# EAGLE design untitled (EAGLE 9.6.2)
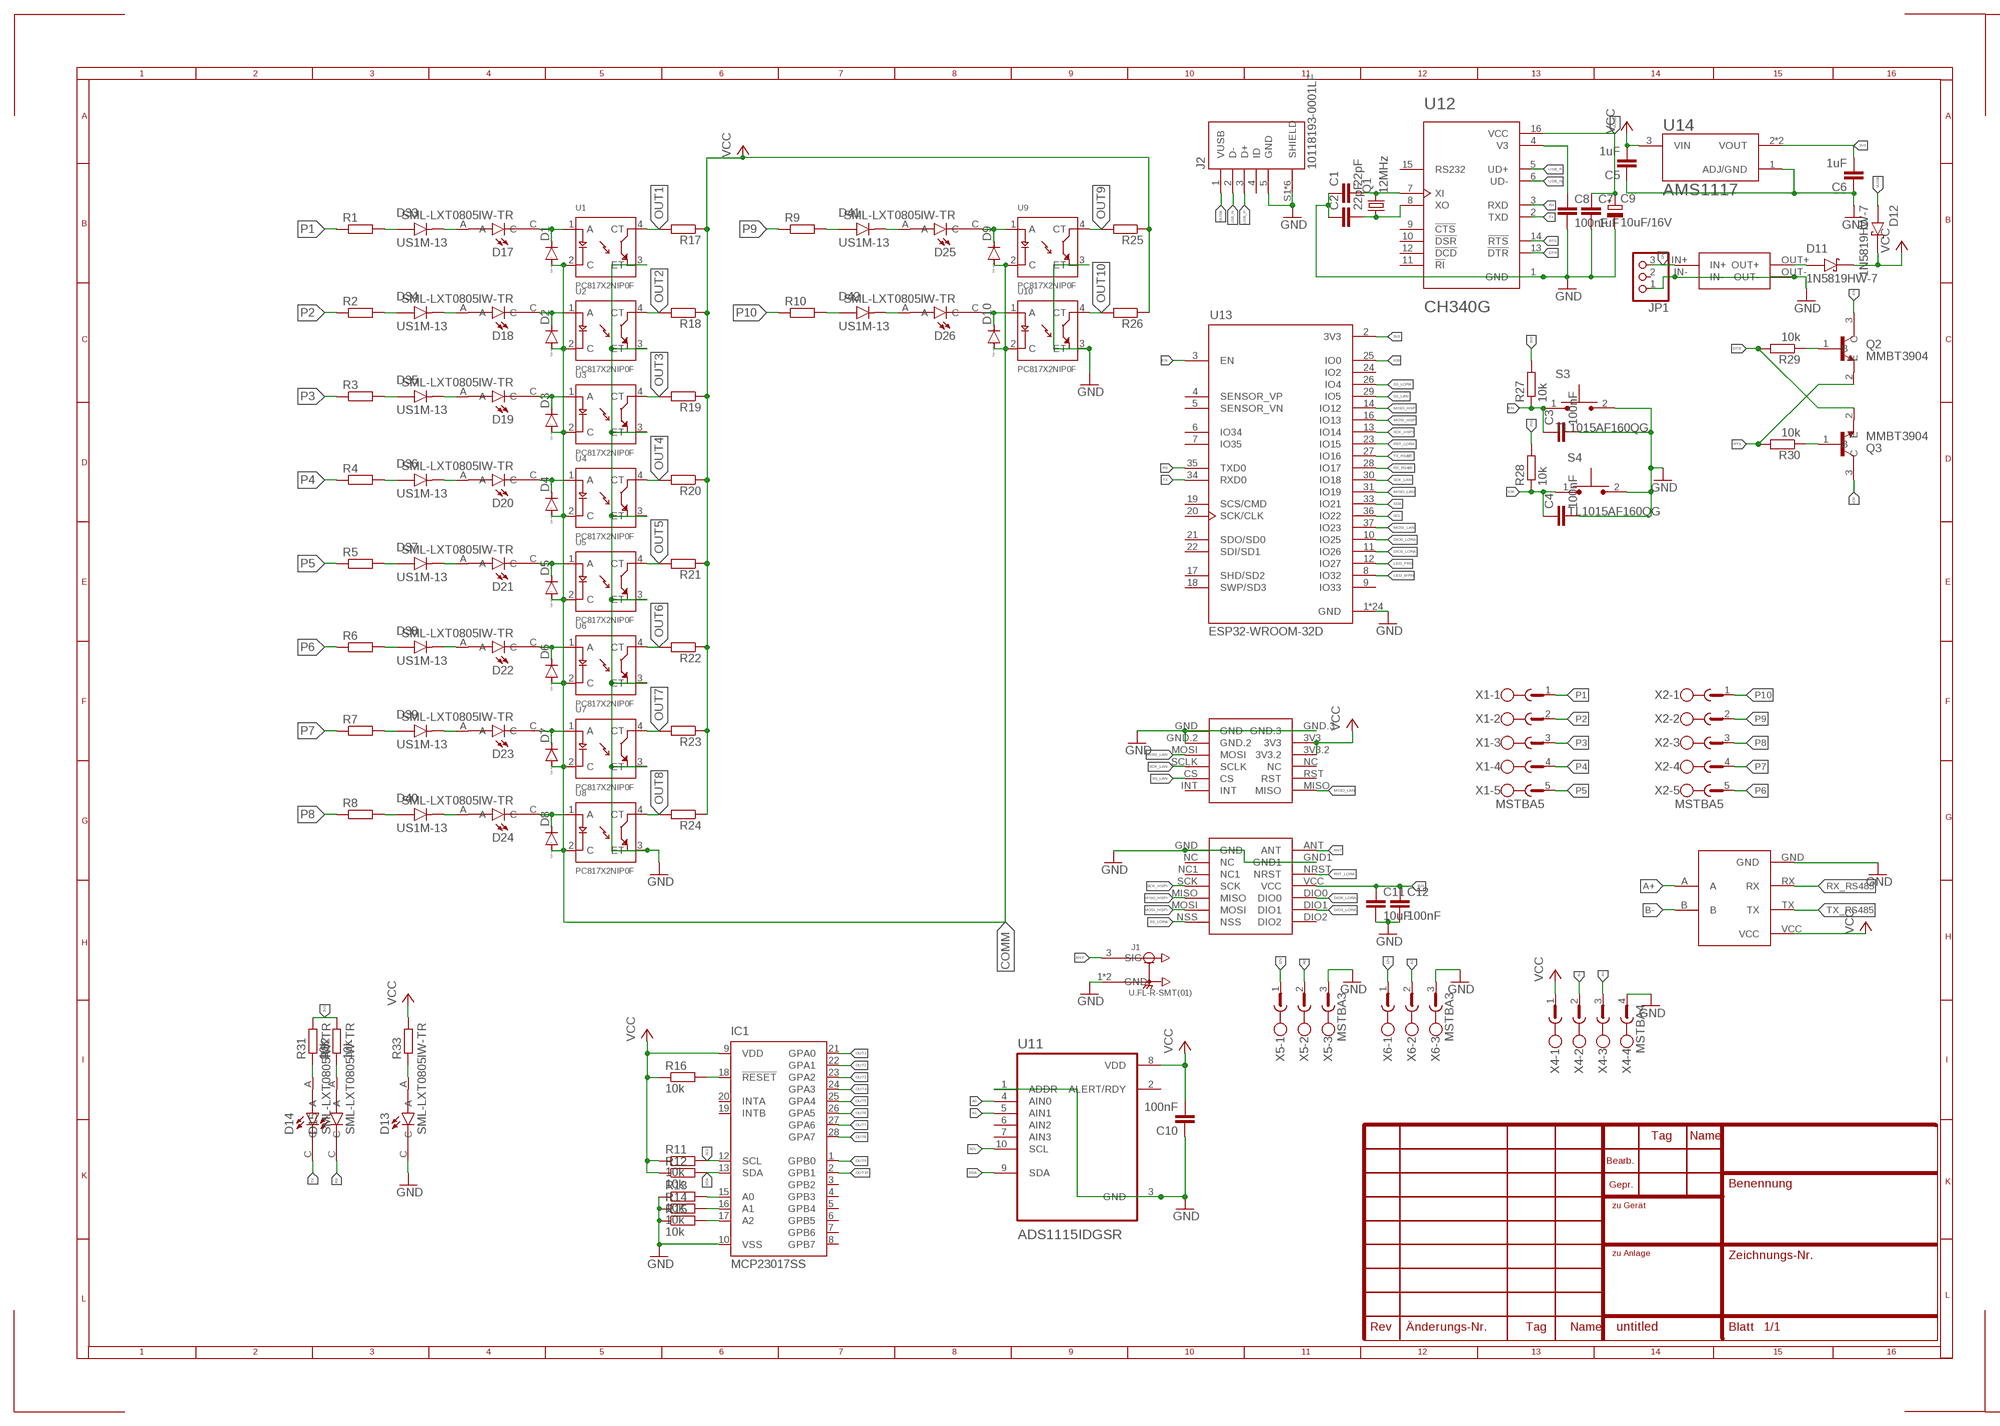
[diagram p0: schematic, sheet 1, part 1 of 2]
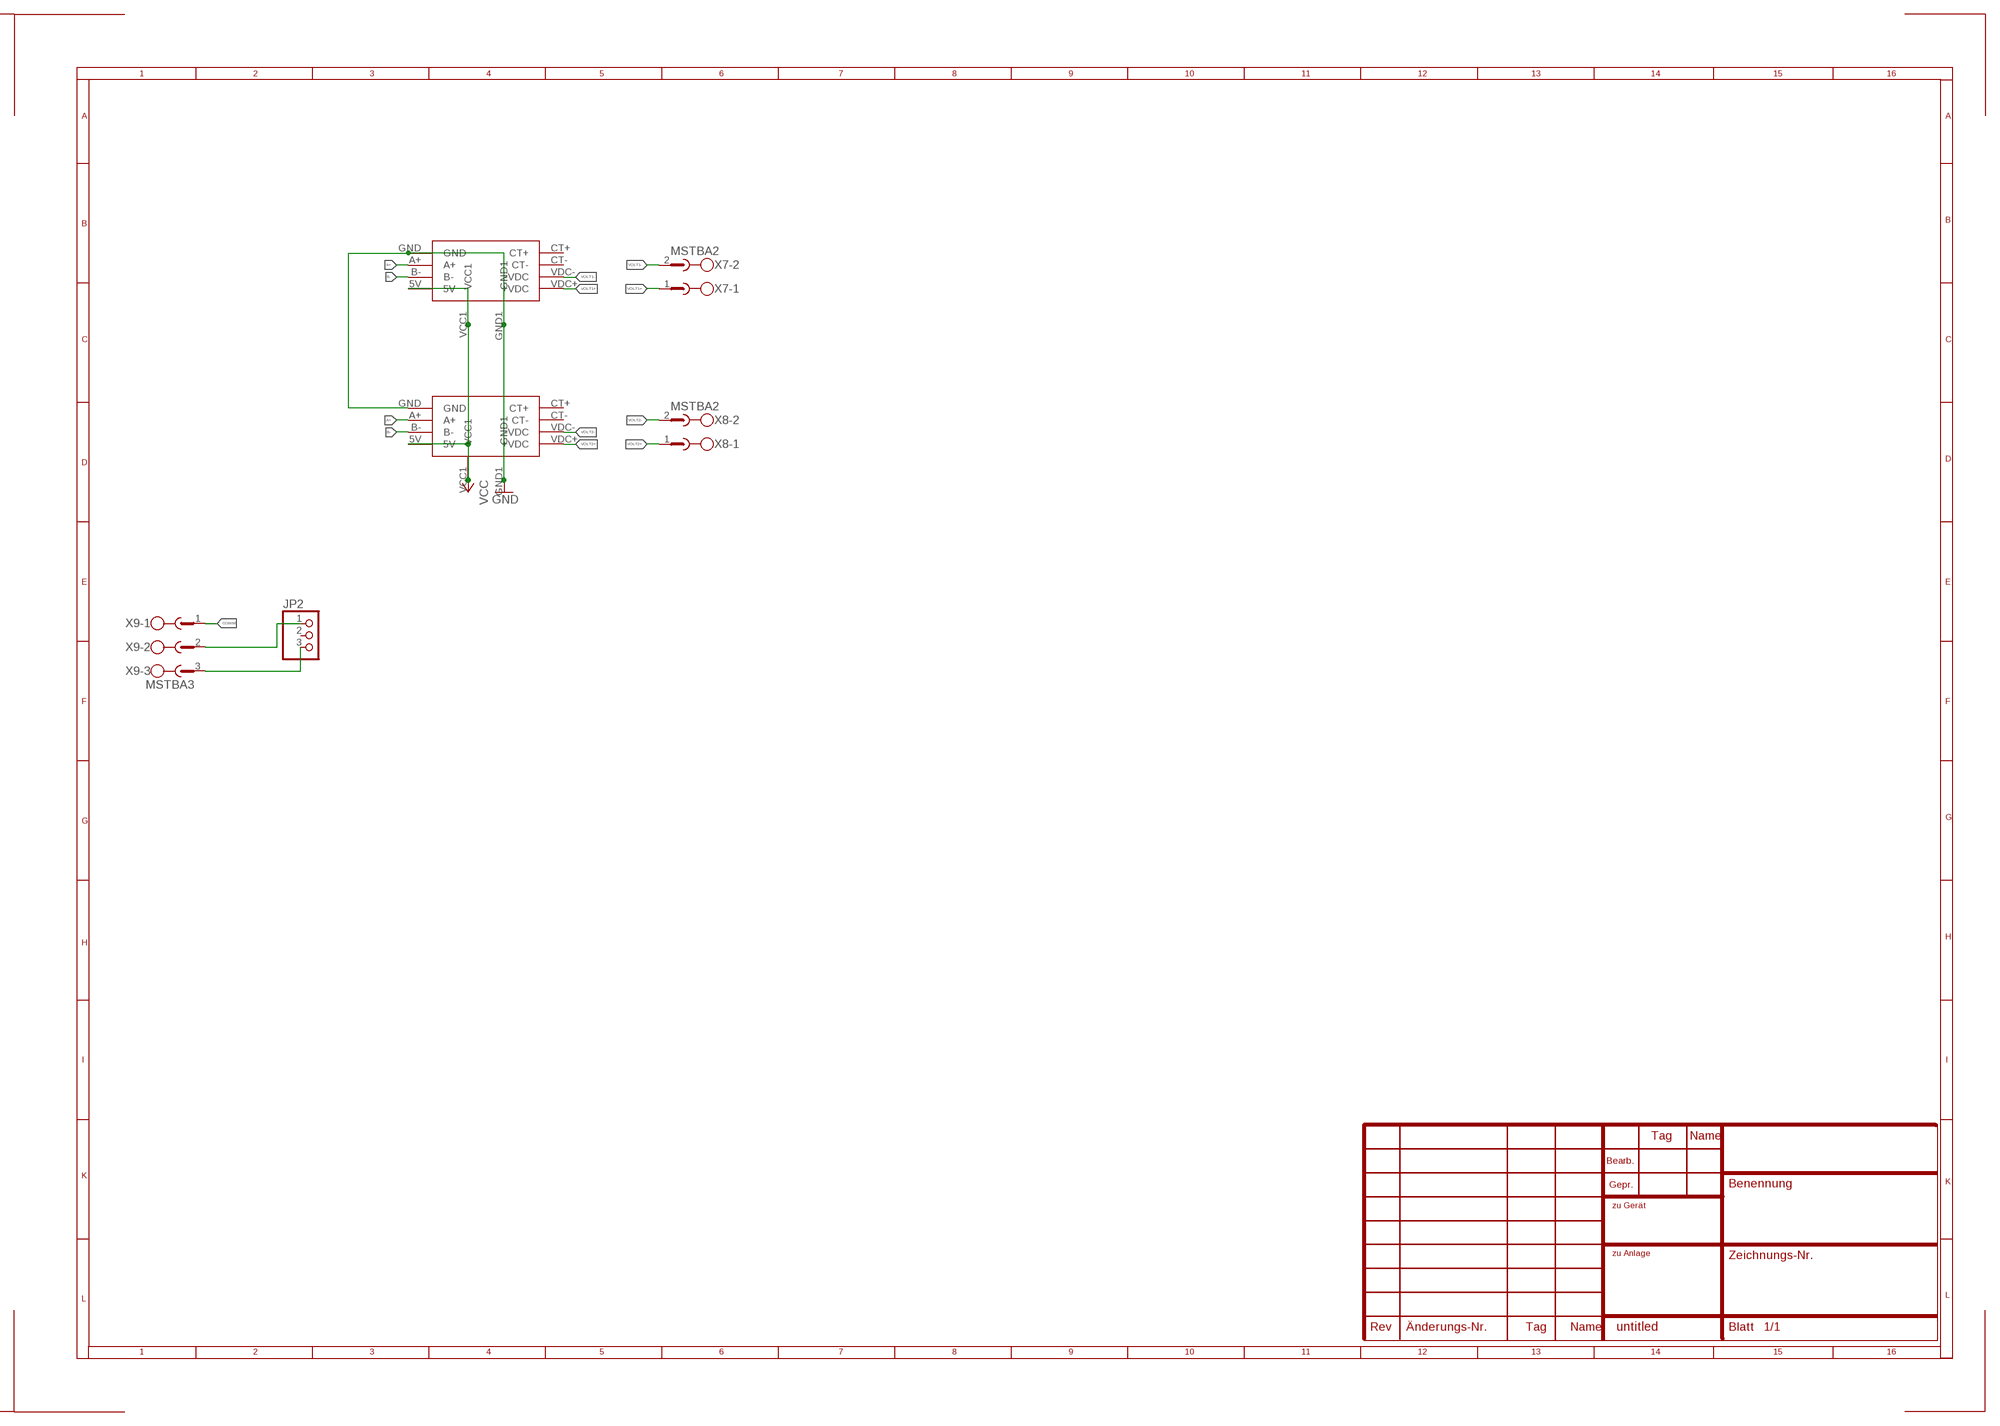
[diagram p1: schematic, sheet 1, part 2 of 2]

## Parts
C1  22pF  C-EUC0805K  [C0805K]
C2  22pF  C-EUC0805K  [C0805K]
C3  100nF  C-EUC0805K  [C0805K]
C4  100nF  C-EUC0805K  [C0805K]
C5  1uF  C-EUC0805K  [C0805K]
C6  1uF  C-EUC0805K  [C0805K]
C7  1uF  C-EUC0805K  [C0805K]
C8  100nF  C-EUC0805K  [C0805K]
C9  10uF/16V  CPOL-EU153CLV-0505  [153CLV-0505]
C10  100nF  C-EUC0805K  [C0805K]
C11  10uF  C-EUC0805K  [C0805K]
C12  100nF  C-EUC0805K  [C0805K]
D1  DIODE-SOD123  [SOD123]
D2  DIODE-SOD123  [SOD123]
D3  DIODE-SOD123  [SOD123]
D4  DIODE-SOD123  [SOD123]
D5  DIODE-SOD123  [SOD123]
D6  DIODE-SOD123  [SOD123]
D7  DIODE-SOD123  [SOD123]
D8  DIODE-SOD123  [SOD123]
D9  DIODE-SOD123  [SOD123]
D10  DIODE-SOD123  [SOD123]
D11  1N5819HW-7  [SOD3715X145N]
D12  1N5819HW-7  [SOD3715X145N]
D13  SML-LXT0805IW-TR  [LEDC2012X120N]
D14  SML-LXT0805IW-TR  [LEDC2012X120N]
D15  SML-LXT0805IW-TR  [LEDC2012X120N]
D17  SML-LXT0805IW-TR  [LEDC2012X120N]
D18  SML-LXT0805IW-TR  [LEDC2012X120N]
D19  SML-LXT0805IW-TR  [LEDC2012X120N]
D20  SML-LXT0805IW-TR  [LEDC2012X120N]
D21  SML-LXT0805IW-TR  [LEDC2012X120N]
D22  SML-LXT0805IW-TR  [LEDC2012X120N]
D23  SML-LXT0805IW-TR  [LEDC2012X120N]
D24  SML-LXT0805IW-TR  [LEDC2012X120N]
D25  SML-LXT0805IW-TR  [LEDC2012X120N]
D26  SML-LXT0805IW-TR  [LEDC2012X120N]
D33  US1M-13  [DIOM5226X240N]
D34  US1M-13  [DIOM5226X240N]
D35  US1M-13  [DIOM5226X240N]
D36  US1M-13  [DIOM5226X240N]
D37  US1M-13  [DIOM5226X240N]
D38  US1M-13  [DIOM5226X240N]
D39  US1M-13  [DIOM5226X240N]
D40  US1M-13  [DIOM5226X240N]
D41  US1M-13  [DIOM5226X240N]
D42  US1M-13  [DIOM5226X240N]
IC1  MCP23017SS  [SSOP28]
J1  U.FL-R-SMT(01)  [HRS_U.FL-R-SMT(01)]
J2  10118193-0001LF  [FCI_10118193-0001LF]
JP1  PINHD-1X3CB  [1X03-CLEANBIG]
JP2  PINHD-1X3CB  [1X03-CLEANBIG]
LORA-NICERF-V1  LORA-NICERF-V2  [LORA-NICERF-V2]
MINI1  MINI560  [MINI560]
PZEM-DC1  PZEM-DC  [PZEM-DC]
PZEM-DC2  PZEM-DC  [PZEM-DC]
Q1  12MHz  CRYSTALSM49  [SM49]
Q2  MMBT3904  [SOT95P240X120-3N]
Q3  MMBT3904  [SOT95P240X120-3N]
R1  R-EU_0414/15  [0414/15]
R2  R-EU_0414/15  [0414/15]
R3  R-EU_0414/15  [0414/15]
R4  R-EU_0414/15  [0414/15]
R5  R-EU_0414/15  [0414/15]
R6  R-EU_0414/15  [0414/15]
R7  R-EU_0414/15  [0414/15]
R8  R-EU_0414/15  [0414/15]
R9  R-EU_0414/15  [0414/15]
R10  R-EU_0414/15  [0414/15]
R11  10k  R-EU_R0805  [R0805]
R12  10k  R-EU_R0805  [R0805]
R13  10k  R-EU_R0805  [R0805]
R14  10k  R-EU_R0805  [R0805]
R15  10k  R-EU_R0805  [R0805]
R16  10k  R-EU_R0805  [R0805]
R17  R-EU_R0805  [R0805]
R18  R-EU_R0805  [R0805]
R19  R-EU_R0805  [R0805]
R20  R-EU_R0805  [R0805]
R21  R-EU_R0805  [R0805]
R22  R-EU_R0805  [R0805]
R23  R-EU_R0805  [R0805]
R24  R-EU_R0805  [R0805]
R25  R-EU_R0805  [R0805]
R26  R-EU_R0805  [R0805]
R27  10k  R-EU_R0805  [R0805]
R28  10k  R-EU_R0805  [R0805]
R29  10k  R-EU_R0805  [R0805]
R30  10k  R-EU_R0805  [R0805]
R31  10k  R-EU_R0805  [R0805]
R32  10k  R-EU_R0805  [R0805]
R33  330  R-EU_R0805  [R0805]
S3  TL1015AF160QG  [SW_TL1015AF160QG]
S4  TL1015AF160QG  [SW_TL1015AF160QG]
TTL-RS1  TTL-RS485  [TTL-RS485]
U1  PC817X2NIP0F  [SOT254P975X400-4N]
U2  PC817X2NIP0F  [SOT254P975X400-4N]
U3  PC817X2NIP0F  [SOT254P975X400-4N]
U4  PC817X2NIP0F  [SOT254P975X400-4N]
U5  PC817X2NIP0F  [SOT254P975X400-4N]
U6  PC817X2NIP0F  [SOT254P975X400-4N]
U7  PC817X2NIP0F  [SOT254P975X400-4N]
U8  PC817X2NIP0F  [SOT254P975X400-4N]
U9  PC817X2NIP0F  [SOT254P975X400-4N]
U10  PC817X2NIP0F  [SOT254P975X400-4N]
U11  ADS1115IDGSR  [SOP50P490X110-10N]
U12  CH340G  [SOIC127P600X180-16N]
U13  ESP32-WROOM-32D  [MODULE_ESP32-WROOM-32D]
U14  AMS1117  [SOT229P700X180-4N]
U$1  MINI_W5500  [MINI_W5500]
X1  MSTBA5  [MSTBA5]
X2  MSTBA5  [MSTBA5]
X4  MSTBA4  [MSTBA4]
X5  MSTBA3  [MSTBA3]
X6  MSTBA3  [MSTBA3]
X7  MSTBA2  [MSTBA2]
X8  MSTBA2  [MSTBA2]
X9  MSTBA3  [MSTBA3]

## Nets
3V3: C6.2 C11.1 C12.1 LORA-NICERF-V1.VCC R27.2 R28.2 R31.2 R32.2 U13.2(3V3) U14.2(VOUT) U14.4(VOUT)
12V: JP1.3 MINI1.IN+ X5.1 X6.1
A0: U11.4(AIN0) X5.2
A1: U11.5(AIN1) X6.2
A+: PZEM-DC1.A+ PZEM-DC2.A+ TTL-RS1.A X4.3
ANT: J1.3(SIG) LORA-NICERF-V1.ANT
B-: PZEM-DC1.B- PZEM-DC2.B- TTL-RS1.B X4.2
COMM: D1.A D2.A D3.A D4.A D5.A D6.A D7.A D8.A D9.A D10.A U1.2(C) U2.2(C) U3.2(C) U4.2(C) U5.2(C) U6.2(C) U7.2(C) U8.2(C) U9.2(C) U10.2(C) X9.1
DIO0_LORA: LORA-NICERF-V1.DIO0 U13.10(IO25)
DIO1_LORA: LORA-NICERF-V1.DIO1 U13.11(IO26)
DTR: Q3.2(E) R29.2 U12.13(!DTR)
EN: C3.1 Q2.3(C) R27.1 S3.1 U13.3(EN)
GND: C1.1 C2.1 C3.2 C4.2 C5.1 C6.1 C7.2 C8.2 C9.- C10.1 C11.2 C12.2 D13.C IC1.10(VSS) J1.1(GND) J1.2(GND) J2.5(GND) J2.S1(SHIELD) J2.S2(SHIELD) J2.S3(SHIELD) J2.S4(SHIELD) J2.S5(SHIELD) J2.S6(SHIELD) JP1.1 LORA-NICERF-V1.GND LORA-NICERF-V1.GND1 MINI1.IN- MINI1.OUT- PZEM-DC1.GND PZEM-DC1.GND1 PZEM-DC2.GND PZEM-DC2.GND1 R13.1 R14.1 R15.1 S3.2 S4.2 TTL-RS1.GND U1.3(ET) U2.3(ET) U3.3(ET) U4.3(ET) U5.3(ET) U6.3(ET) U7.3(ET) U8.3(ET) U9.3(ET) U10.3(ET) U11.1(ADDR) U11.3(GND) U12.1(GND) U13.1(GND) U13.15(GND) U13.38(GND) U13.39_1(GND) U13.39_2(GND) U13.39_3(GND) U13.39_4(GND) U13.39_5(GND) U13.39_6(GND) U13.39_7(GND) U13.39_8(GND) U13.39_9(GND) U13.39_10(GND) U13.39_11(GND) U13.39_12(GND) U13.39_13(GND) U13.39_14(GND) U13.39_15(GND) U13.39_16(GND) U13.39_17(GND) U13.39_18(GND) U13.39_19(GND) U13.39_20(GND) U13.39_21(GND) U14.1(ADJ/GND) U$1.GND U$1.GND.2 U$1.GND.3 X4.4 X5.3 X6.3
IO0: C4.1 Q3.3(C) R28.1 S4.1 U13.25(IO0)
LED_PRS: U13.12(IO27)
LED_WRN: U13.8(IO32)
MISO_HSPI: LORA-NICERF-V1.MISO U13.14(IO12)
MISO_LAN: U13.31(IO19) U$1.MISO
MOSI_HSPI: LORA-NICERF-V1.MOSI U13.16(IO13)
MOSI_LAN: U13.37(IO23) U$1.MOSI
N$1: D17.A D33.C(K)
N$2: D33.A R1.2
N$3: D1.C D17.C U1.1(A)
N$4: JP2.3 X9.3
N$5: D34.A R2.2
N$6: D18.A D34.C(K)
N$7: D2.C D18.C U2.1(A)
N$8: D35.A R3.2
N$9: D19.A D35.C(K)
N$10: D3.C D19.C U3.1(A)
N$11: D36.A R4.2
N$12: D20.A D36.C(K)
N$13: D4.C D20.C U4.1(A)
N$14: JP2.1 X9.2
N$15: D11.A MINI1.OUT+
N$16: D13.A R33.1
N$17: D37.A R5.2
N$18: D21.A D37.C(K)
N$19: D5.C D21.C U5.1(A)
N$20: D38.A R6.2
N$21: D22.A D38.C(K)
N$22: D6.C D22.C U6.1(A)
N$23: IC1.18(!RESET) R16.2
N$24: C8.1 U12.4(V3)
N$25: D39.A R7.2
N$26: D23.A D39.C(K)
N$27: D7.C D23.C U7.1(A)
N$28: D40.A R8.2
N$29: D24.A D40.C(K)
N$30: D8.C D24.C U8.1(A)
N$32: IC1.15(A0) R13.2
N$33: D41.A R9.2
N$34: D25.A D41.C(K)
N$35: D9.C D25.C U9.1(A)
N$36: D42.A R10.2
N$37: D26.A D42.C(K)
N$38: D10.C D26.C U10.1(A)
N$39: IC1.16(A1) R14.2
N$40: IC1.17(A2) R15.2
N$42: D14.A R31.1
N$43: D15.A R32.1
N$51: Q2.1(B) R29.1
N$52: Q3.1(B) R30.1
N$54: C1.2 Q1.2 U12.7(XI)
N$55: C2.2 Q1.1 U12.8(XO)
OUT1: IC1.21(GPA0) R17.2 U1.4(CT)
OUT2: IC1.22(GPA1) R18.2 U2.4(CT)
OUT3: IC1.23(GPA2) R19.2 U3.4(CT)
OUT4: IC1.24(GPA3) R20.2 U4.4(CT)
OUT5: IC1.25(GPA4) R21.2 U5.4(CT)
OUT6: IC1.26(GPA5) R22.2 U6.4(CT)
OUT7: IC1.27(GPA6) R23.2 U7.4(CT)
OUT8: IC1.28(GPA7) R24.2 U8.4(CT)
OUT9: IC1.1(GPB0) R25.2 U9.4(CT)
OUT10: IC1.2(GPB1) R26.2 U10.4(CT)
P1: R1.1 X1.1
P2: R2.1 X1.2
P3: R3.1 X1.3
P4: R4.1 X1.4
P5: R5.1 X1.5
P6: R6.1 X2.5
P7: R7.1 X2.4
P8: R8.1 X2.3
P9: R9.1 X2.2
P10: R10.1 X2.1
RST_LORA: LORA-NICERF-V1.NRST U13.23(IO15)
RTS: Q2.2(E) R30.2 U12.14(!RTS)
RX: D15.C U12.3(RXD) U13.35(TXD0)
RX_RS485: TTL-RS1.RX U13.28(IO17)
SCK_HSPI: LORA-NICERF-V1.SCK U13.13(IO14)
SCK_LAN: U13.30(IO18) U$1.SCLK
SCL: IC1.12(SCL) R11.2 U11.10(SCL) U13.36(IO22)
SDA: IC1.13(SDA) R12.2 U11.9(SDA) U13.33(IO21)
SS_LAN: U13.29(IO5) U$1.CS
SS_LORA: LORA-NICERF-V1.NSS U13.26(IO4)
TX: D14.C U12.2(TXD) U13.34(RXD0)
TX_RS485: TTL-RS1.TX U13.27(IO16)
USB_N: J2.2(D-) U12.6(UD-)
USB_P: J2.3(D+) U12.5(UD+)
VCC: C5.2 C10.2 D11.C(K) D12.C(K) IC1.9(VDD) PZEM-DC1.5V PZEM-DC1.VCC1 PZEM-DC2.5V PZEM-DC2.VCC1 R11.1 R12.1 R16.1 R17.1 R18.1 R19.1 R20.1 R21.1 R22.1 R23.1 R24.1 R25.1 R26.1 R33.2 TTL-RS1.VCC U11.8(VDD) U14.3(VIN) U$1.3V3 U$1.3V3.2 X4.1
VOLT1+: PZEM-DC1.VDC+(+VDC) X7.1
VOLT1-: PZEM-DC1.VDC-(-VDC) X7.2
VOLT2+: PZEM-DC2.VDC+(+VDC) X8.1
VOLT2-: PZEM-DC2.VDC-(-VDC) X8.2
VUSB: C7.1 C9.+ D12.A J2.1(VUSB) U12.16(VCC)
Unconnected: IC1.3(GPB2) IC1.4(GPB3) IC1.5(GPB4) IC1.6(GPB5) IC1.7(GPB6) IC1.8(GPB7) IC1.19(INTB) IC1.20(INTA) J2.4(ID) JP1.2 JP2.2 LORA-NICERF-V1.DIO2 LORA-NICERF-V1.NC LORA-NICERF-V1.NC1 PZEM-DC1.CT+ PZEM-DC1.CT- PZEM-DC2.CT+ PZEM-DC2.CT- U11.2(ALERT/RDY) U11.6(AIN2) U11.7(AIN3) U12.9(!CTS) U12.10(!DSR) U12.11(!RI) U12.12(!DCD) U12.15(RS232) U13.4(SENSOR_VP) U13.5(SENSOR_VN) U13.6(IO34) U13.7(IO35) U13.9(IO33) U13.17(SHD/SD2) U13.18(SWP/SD3) U13.19(SCS/CMD) U13.20(SCK/CLK) U13.21(SDO/SD0) U13.22(SDI/SD1) U13.24(IO2) U$1.INT U$1.NC U$1.RST

## Library data of the parts
C1-C8 C10-C12 = rcl:C-EU: CAPACITOR, European symbol; SPICEPREFIX: C
C9 = rcl:CPOL-EU: POLARIZED CAPACITOR, European symbol; SPICEPREFIX: C
D1-D10 = diode:DIODE-: DIODE
D11 D12 = 1N5819HW-7:1N5819HW-7: 1N5819HW Series 40 V 1 A Surface Mount Schottky Barrier Rectifier - SOD-123 Check availability <https://pricing.snapeda.com/parts/1N5819HW-7/Diodes%20Inc./view-part?ref=eda>; AVAILABILITY: In Stock; DESCRIPTION: Diode Schottky 40 V 1A Surface Mount SOD-123; MF: Diodes Inc.; MP: 1N5819HW-7; PACKAGE: SOD-123 Fairchild Semiconductor; PRICE: None; PURCHASE-URL: https://pricing.snapeda.com/search/part/1N5819HW-7/?ref=eda
D13-D15 D17-D26 = SML-LXT0805IW-TR:SML-LXT0805IW-TR: LED; Luminous Intensity:11µcd; Viewing Angle:140°; Forward Current:30mA; Forward Voltage:2V; Color:Red; LED Color:Red; Leaded Process Compatible:Yes; Lens Color:White; Mounting Type:Surface Mount ;RoHS Compliant: Yes Check availability <https://pricing.snapeda.com/parts/SML-LXT0805IW-TR/Lumex%20Opto/Components/view-part?ref=eda>; AVAILABILITY: In Stock; DESCRIPTION: Red - LED Indication - Discrete 2V 0805 (2012 Metric); MF: Lumex Opto/Components; MP: SML-LXT0805IW-TR; PACKAGE: 0805 Lumex; PRICE: None; PURCHASE-URL: https://pricing.snapeda.com/search/part/SML-LXT0805IW-TR/?ref=eda
D33-D42 = US1M-13:US1M-13: Diode, Fast Recovery, 1a, 1kv, Do-214ac-2, Full Reel Check availability <https://pricing.snapeda.com/parts/US1M-13/Diodes%20Incorporated/view-part?ref=eda>; AVAILABILITY: In Stock; DESCRIPTION: Diode Standard 1000 V 1A Surface Mount SMA; MF: Diodes Incorporated; MP: US1M-13; PACKAGE: DO-214AC-214 Diodes Incorporated; PRICE: None; PURCHASE-URL: https://pricing.snapeda.com/search/part/US1M-13/?ref=eda
IC1 = microchip:MCP23017: http://ww1.microchip.com/downloads/en/DeviceDoc/21952a.pdf Source: http://ww1.microchip.com/downloads/en/DeviceDoc/21952a.pdf; MF: MICROCHIP; MPN: MCP23017-E/SS; OC_FARNELL: 1467674; OC_NEWARK: 31K2960
J1 = U.FL-R-SMT_01_:U.FL-R-SMT(01): U.FL Series 6 Ghz 50 Ohm Ultra-small SMT Coaxial Cable Receptacle Check availability <https://pricing.snapeda.com/parts/U.FL-R-SMT%2801%29/Hirose/view-part?ref=eda>; AVAILABILITY: In Stock; DESCRIPTION: U.FL (UMCC) Connector Receptacle, Male Pin 50Ohm Surface Mount Solder. RF Connectors / Coaxial Connectors; MF: Hirose; MP: U.FL-R-SMT(01); PACKAGE: None; PRICE: None; PURCHASE-URL: https://pricing.snapeda.com/search/part/U.FL-R-SMT(01)/?ref=eda
J2 = 10118193-0001LF:10118193-0001LF: Micro USB B Type Receptacle Check availability <https://pricing.snapeda.com/parts/10118193-0001LF/FCI/view-part?ref=eda>; AVAILABILITY: In Stock; DESCRIPTION: USB - micro B USB 2.0 Receptacle Connector 5 Position Surface Mount, Right Angle; Through Hole; MF: FCI; MP: 10118193-0001LF; PACKAGE: None; PRICE: None; PURCHASE-URL: https://pricing.snapeda.com/search/part/10118193-0001LF/?ref=eda
JP1 JP2 = adafruit:PINHD-1X3: PIN HEADER
LORA-NICERF-V1 = LORA-NICERF-V2:LORA-NICERF-V2
MINI1 = MINI560:MINI560
PZEM-DC1 PZEM-DC2 = pzem-dc:PZEM-DC
Q1 = crystal:CRYSTAL: CRYSTAL; OC_FARNELL: unknown; OC_NEWARK: unknown
Q2 Q3 = MMBT3904:MMBT3904: MMBT3904 Series 40 V CE Breakdown 0.2 A NPN General Purpose Amplifier - SOT-23 Check availability <https://pricing.snapeda.com/parts/MMBT3904/ON%20Semiconductor/view-part?ref=eda>; AVAILABILITY: In Stock; DESCRIPTION: Bipolar (BJT) Transistor NPN 40 V 200 mA 300MHz 300 mW Surface Mount SOT-23-3 (TO-236); MF: ON Semiconductor; MP: MMBT3904; PACKAGE: SOT-23-3 Motorola; PRICE: None
R1-R33 = rcl:R-EU_: RESISTOR, European symbol; SPICEPREFIX: R
S3 S4 = TL1015AF160QG:TL1015AF160QG: Tactile Switch SPST-NO Top Actuated Surface Mount Check availability <https://pricing.snapeda.com/parts/TL1015AF160QG/E-Switch/view-part?ref=eda>; AVAILABILITY: In Stock; DESCRIPTION: Tactile Switch SPST-NO Top Actuated Surface Mount; MF: E-Switch; MP: TL1015AF160QG; PACKAGE: None; PRICE: None; PURCHASE-URL: https://pricing.snapeda.com/search/part/TL1015AF160QG/?ref=eda
TTL-RS1 = TTL-RS485:TTL-RS485
U1-U10 = PC817X2NIP0F:PC817X2NIP0F: PC817 Series 1 Channel 80 V 5000 Vrms General Purpose Photocoupler - DIP-4 Check availability <https://pricing.snapeda.com/parts/PC817X2NIP0F/Sharp%20Microelectronics/view-part?ref=eda>; AVAILABILITY: Not in stock; DESCRIPTION: Optoisolator Transistor Output 5000Vrms 1 Channel 4-SMD; MF: Sharp Microelectronics; MP: PC817X2NIP0F; PACKAGE: SMD-4 Sharp Microelectronics; PRICE: None
U11 = ADS1115IDGSR:ADS1115IDGSR: Check availability <https://pricing.snapeda.com/parts/ADS1115IDGSR/Texas%20Instruments/view-part?ref=eda>; AVAILABILITY: In Stock; DESCRIPTION: 16-bit, 860-SPS, 4-channel, delta-sigma ADC with PGA, oscillator, VREF, comparator and I2C; MF: Texas Instruments; MP: ADS1115IDGSR; PACKAGE: VSSOP-10 Texas Instruments; PRICE: None; PURCHASE-URL: https://pricing.snapeda.com/search/part/ADS1115IDGSR/?ref=eda
U12 = CH340G:CH340G: Check availability <https://pricing.snapeda.com/parts/Ch340G/WCH/view-part?ref=eda>; AVAILABILITY: Not in stock; DESCRIPTION: USB Interface Integrated Circuit; MF: WCH; MP: Ch340G; PACKAGE: None; PRICE: None
U13 = ESP32-WROOM-32D:ESP32-WROOM-32D: Bluetooth, WiFi 802.11b/g/n, Bluetooth v4.2 + EDR, Class 1, 2 and 3 Transceiver Module 2.4GHz ~ 2.5GHz Integrated, Trace Surface Mount Check availability <https://pricing.snapeda.com/parts/ESP32-WROOM-32D/Espressif%20Systems/view-part?ref=eda>; AVAILABILITY: In Stock; DESCRIPTION: Bluetooth, WiFi 802.11b/g/n, Bluetooth v4.2 +EDR, Class 1, 2 and 3 Transceiver Module 2.4GHz ~ 2.5GHz Integrated; MF: Espressif Systems; MP: ESP32-WROOM-32D; PACKAGE: Module Espressif Systems; PRICE: None; PURCHASE-URL: https://pricing.snapeda.com/search/part/ESP32-WROOM-32D/?ref=eda
U14 = AMS1117:AMS1117: Sot223/Pkg 1-Amp 5-Volt Low Drop Out Voltage Regulatator Check availability <https://pricing.snapeda.com/parts/AMS1117/Advanced%20Monolithic%20Systems/view-part?ref=eda>; AVAILABILITY: Not in stock; DESCRIPTION: 1A LOW DROPOUT VOLTAGE REGULATOR SOT-223; MF: Advanced Monolithic Systems; MP: AMS1117; PACKAGE: SOT-223 Seeed Technology; PRICE: None
U$1 = ethernet-mikroavr:MINI_W5500: MINI ETHERNET W5500, CREATE BY MIKROAVR.COM
X1 X2 = con-phoenix-508:MSTBA5: PHOENIX; MPN: 1757271; OC_FARNELL: 3705201; OC_NEWARK: 71C4164
X4 = con-phoenix-508:MSTBA4: PHOENIX; MF: FARNELL; MPN: 1757268; OC_FARNELL: 3705195; OC_NEWARK: 71C4163
X5 X6 X9 = con-phoenix-508:MSTBA3: PHOENIX; MF: FARNELL; MPN: 1757255; OC_FARNELL: 3705183; OC_NEWARK: 71C4162
X7 X8 = con-phoenix-508:MSTBA2: PHOENIX; MF: FARNELL; MPN: 1757242; OC_FARNELL: 3705171; OC_NEWARK: 71C4161

## Board
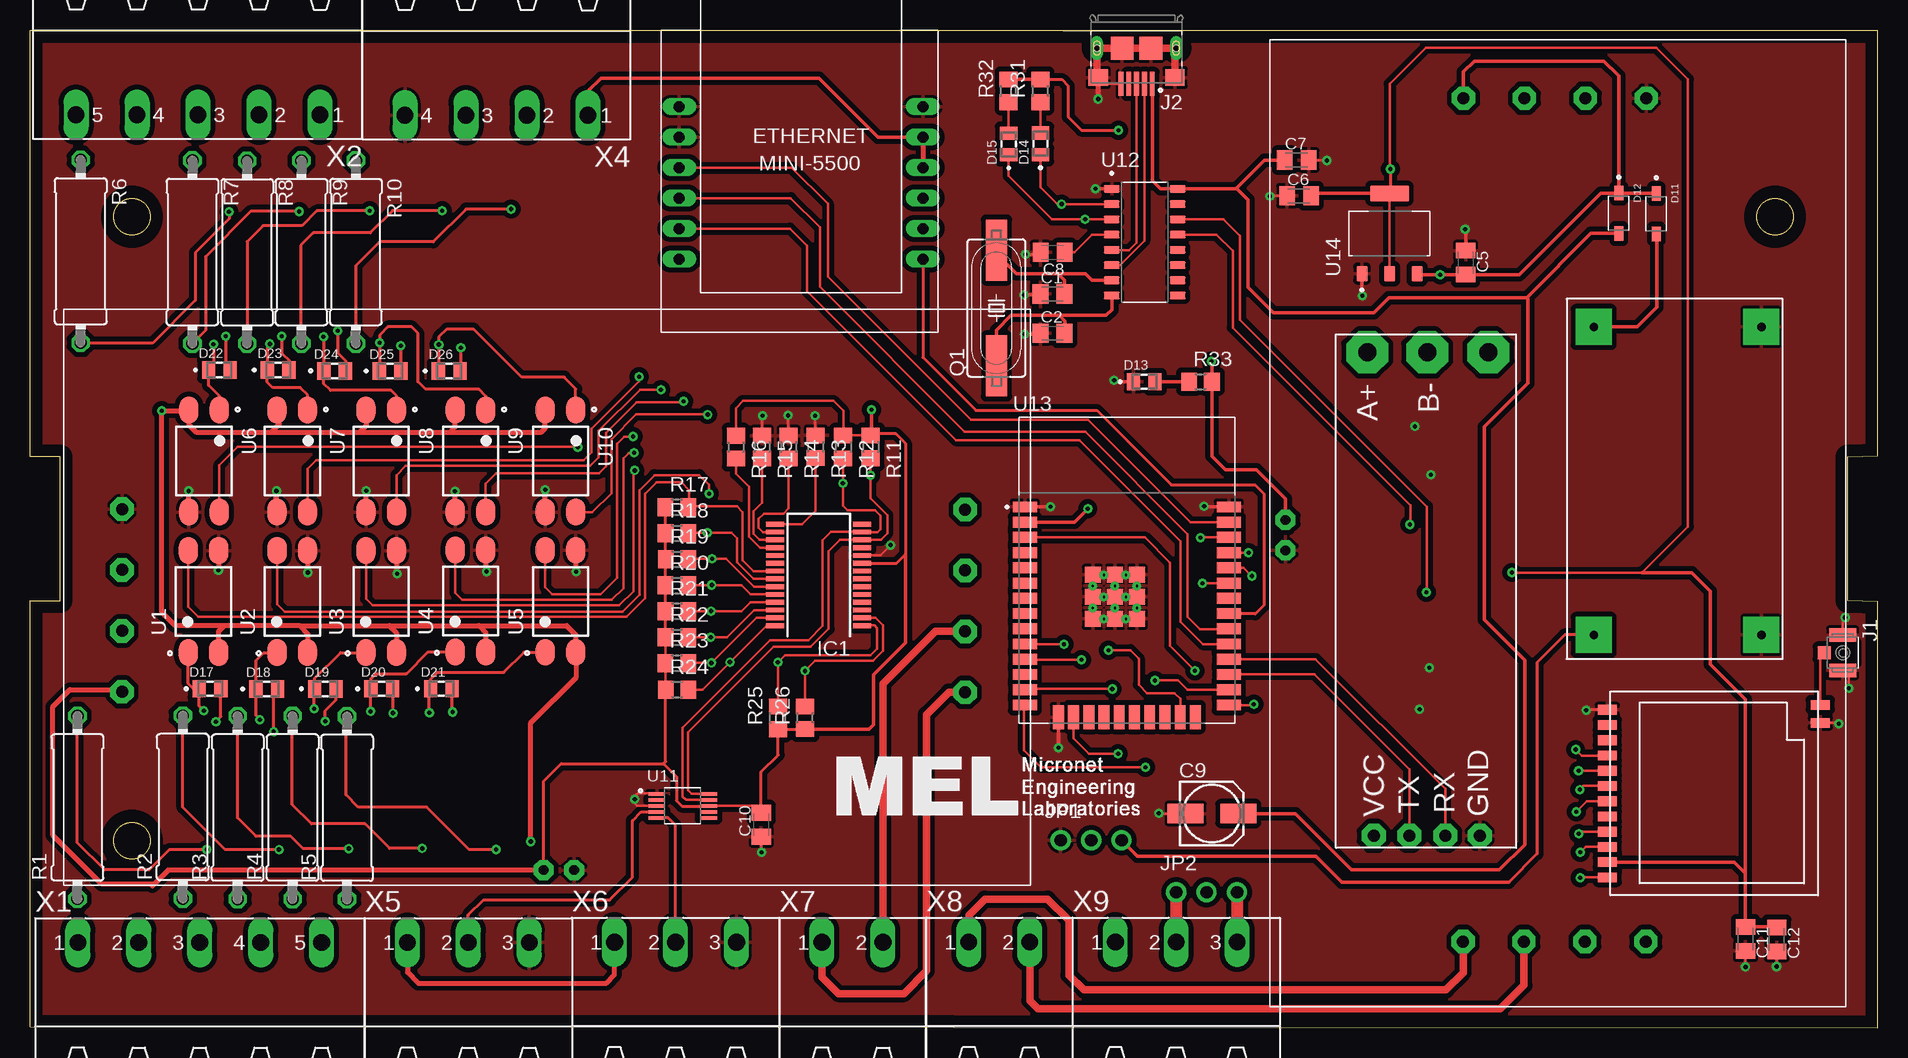
[diagram p2: board, top side]
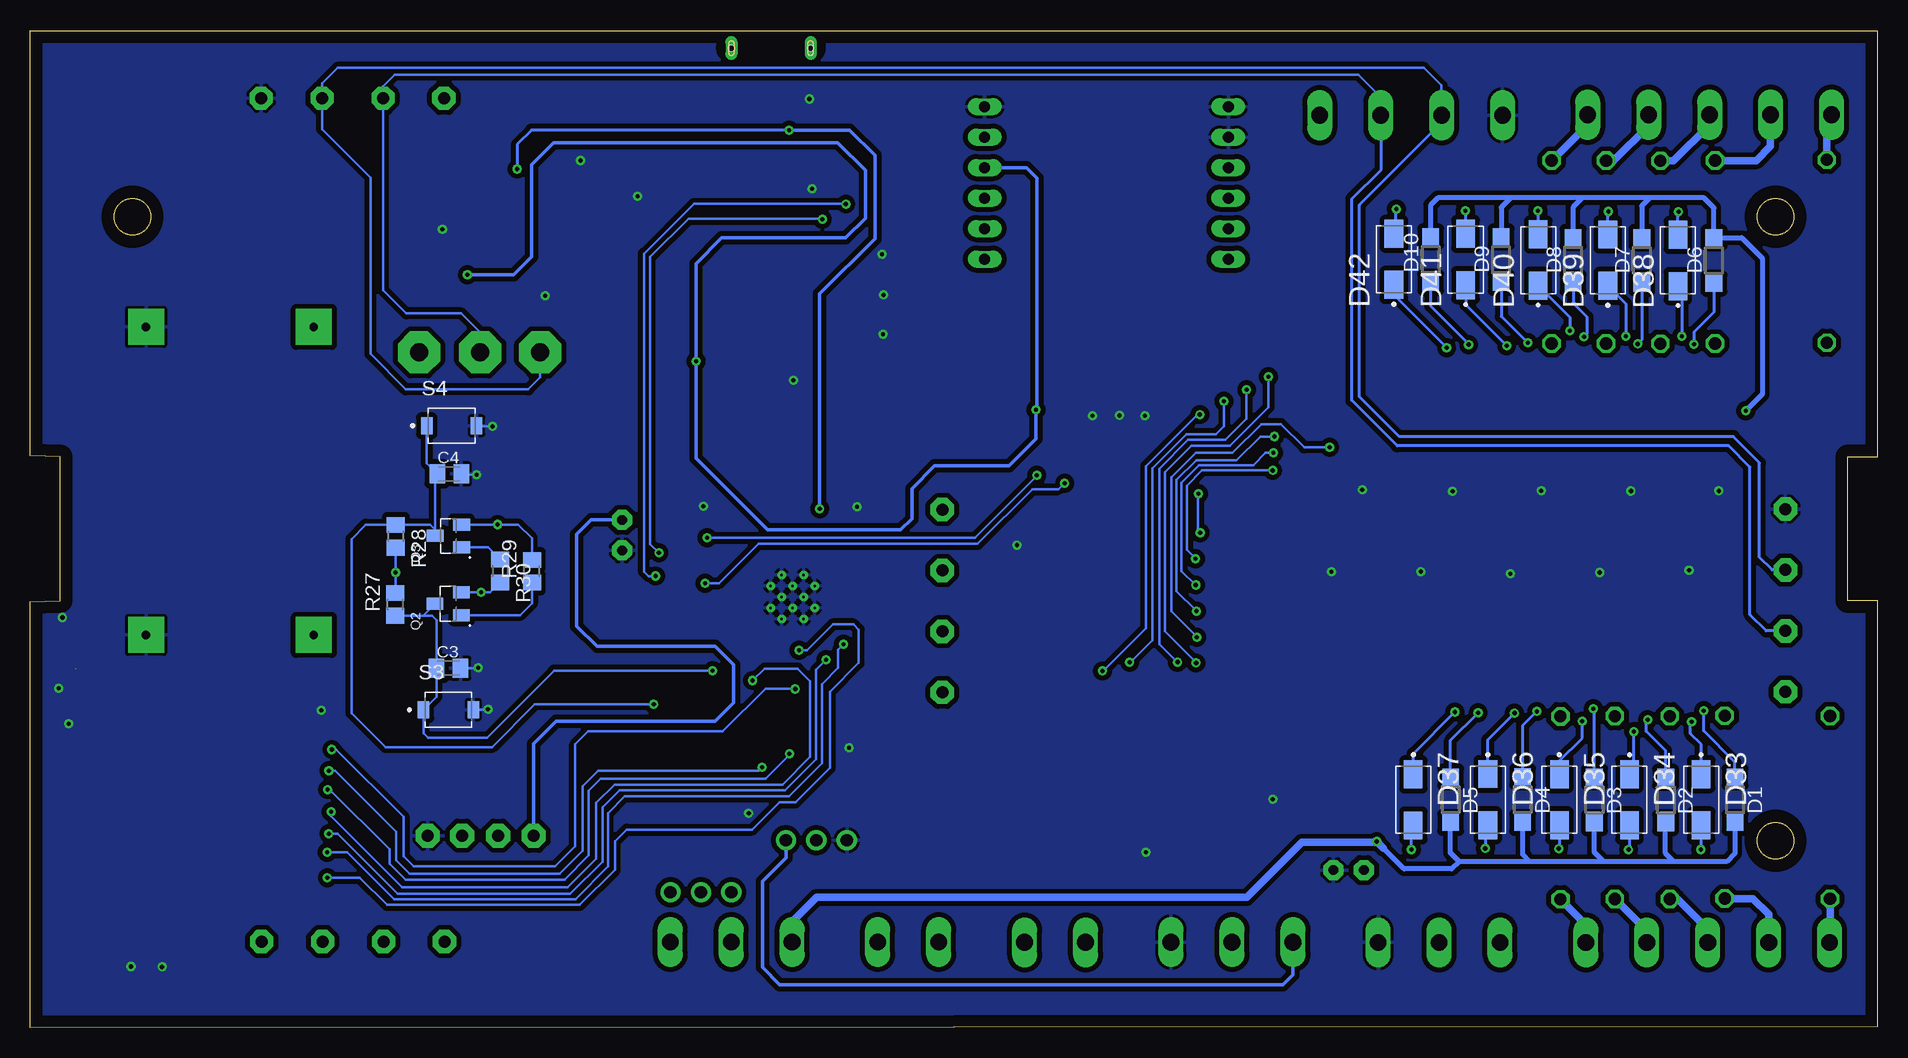
[diagram p3: board, bottom side, seen from below]

Size 154 x 83.1 mm. Coordinates in mm from the lower left corner, seen from the top.
Outline: 0,0.1 154,0 154,35.5 151.5,35.6 151.5,47.6 154,47.7 154,83.1 0,83.1 0,47.6 2.5,47.6 2.5,35.6 0,35.6 0,0.1
Outline: circle at 8.5,67.6 radius 1.5
Outline: circle at 8.5,15.6 radius 1.5
Outline: circle at 145.47,67.6 radius 1.5
Copper layers (1*16): Top 0.035mm / dielectric 1.5mm / Bottom 0.035mm
Design rules "default": minimum track width 6mil, minimum drill 0.35mm, track to track 6mil, track to pad 6mil, pad to pad 6mil, via to via 6mil, smd to smd 6mil, copper to edge 40mil, drill to drill 6mil, minimum pad ring 10mil, minimum via ring 8mil, stop-mask expansion 4mil, vias tented up to drill 0mil, thermal gap 10mil

### Footprints (pad centres in the part's own frame; a part is rotated, then mirrored left to right if it is on the bottom)
C0805K = smd 1.3 x 1.6: 1 -1,0; 2 1,0
153CLV-0505 = smd 3 x 1.6: + 2.2,0; - -2.2,0
SOD123 = smd 1.4 x 1.4: A 1.9,0; C -1.9,0
SOD3715X145N = smd 1.21 x 0.73: A 1.68,0; C -1.68,0
LEDC2012X120N = smd 1.1 x 1.45: A 0.9,0; C -0.9,0
DIOM5226X240N = smd 2.33 x 1.55: A 2.135,0; C -2.135,0
SSOP28 = smd 0.4 x 1.5: 1 -4.225,-3.625; 2 -3.575,-3.625; 3 -2.925,-3.625; 4 -2.275,-3.625; 5 -1.625,-3.625; 6 -0.975,-3.625; 7 -0.325,-3.625; 8 0.325,-3.625; 9 0.975,-3.625; 10 1.625,-3.625; 11 2.275,-3.625; 12 2.925,-3.625; 13 3.575,-3.625; 14 4.225,-3.625; 15 4.225,3.625; 16 3.575,3.625; 17 2.925,3.625; 18 2.275,3.625; 19 1.625,3.625; 20 0.975,3.625; 21 0.325,3.625; 22 -0.325,3.625; 23 -0.975,3.625; 24 -1.625,3.625; 25 -2.275,3.625; 26 -2.925,3.625; 27 -3.575,3.625; 28 -4.225,3.625
HRS_U.FL-R-SMT(01) = smd 1.1 x 2.25: 1 -1.475,0; 2 1.475,0 | smd 1.05 x 1.1: 3 0,-1.55
FCI_10118193-0001LF = smd 0.4 x 2: 1 -1.3,2.975; 2 -0.65,2.975; 3 0,2.975; 4 0.65,2.975; 5 1.3,2.975 | smd 1.6 x 1.4: S1 -3.2,2.45; S2 3.2,2.45 | smd 1.9 x 1.9: S3 1.2,0; S4 -1.2,0 | drill 0.5 pad 0.9 long: S5 -3.3,0; S6 3.3,0 | hole 0.5: -3.3,0; 3.3,0
1X03-CLEANBIG = drill 1.016 pad 1.676: 1 -2.54,0; 2 0,0; 3 2.54,0
LORA-NICERF-V2 = smd 1.6 x 0.8: ANT 9.17,6.81; DIO0 -8.57,-5.03; DIO1 -8.57,-3.76; DIO2 -8.57,-2.49; GND -8.57,6.4; GND1 9.17,5.31; MISO -8.57,1.32; MOSI -8.57,0.05; NC -8.57,5.13; NC1 -8.57,3.86; NRST -8.57,-7.57; NSS -8.57,-1.22; SCK -8.57,2.59; VCC -8.57,-6.3
MINI560 = drill 0.7 pad 3 square: IN+ 0,-1.27; IN- 0,-15.24; OUT+ 25.67,-1.27; OUT- 25.67,-15.24
PZEM-DC = drill 1 pad 1.93 octagon: 5V -2.12,-30.87; A+ -2.12,-20.71; B- -2.12,-25.79; CT+ 68.16,-15.67; CT- 68.16,-20.75; GND -2.12,-15.63; VDC+ 68.16,-30.91; VDC- 68.16,-25.83 | drill 0.8 pad 1.676 octagon: GND1 35.56,-45.72; VCC1 33.02,-45.72
SM49 = smd 5.08 x 1.778: 1 -4.826,0; 2 4.826,0
SOT95P240X120-3N = smd 1 x 1.4: 1 -0.95,-1.1; 2 0.95,-1.1; 3 0,1.1
0414/15 = drill 1.016 octagon: 1 -7.62,0; 2 7.62,0
R0805 = smd 1.3 x 1.5: 1 -0.95,0; 2 0.95,0
SW_TL1015AF160QG = smd 0.95 x 1.4: 1 -2.075,0; 2 2.075,0
TTL-RS485 = drill 1.5 pad 3.5 octagon: A -19.7,-6; B -19.7,-1; P$7 -19.7,4.1 | drill 1 pad 2 octagon: GND 20.6,3.37; RX 20.581,0.505; TX 20.583,-2.493; VCC 20.6,-5.47
SOT254P975X400-4N = smd 2.25 x 1.6: 1 -4.25,1.27; 2 -4.25,-1.27; 3 4.25,-1.27; 4 4.25,1.27
SOP50P490X110-10N = smd 1.47 x 0.28: 1 -2.15,1; 2 -2.15,0.5; 3 -2.15,0; 4 -2.15,-0.5; 5 -2.15,-1; 6 2.15,-1; 7 2.15,-0.5; 8 2.15,0; 9 2.15,0.5; 10 2.15,1
SOIC127P600X180-16N = smd 1.31 x 0.62: 1 -2.75,4.445; 2 -2.75,3.175; 3 -2.75,1.905; 4 -2.75,0.635; 5 -2.75,-0.635; 6 -2.75,-1.905; 7 -2.75,-3.175; 8 -2.75,-4.445; 9 2.75,-4.445; 10 2.75,-3.175; 11 2.75,-1.905; 12 2.75,-0.635; 13 2.75,0.635; 14 2.75,1.905; 15 2.75,3.175; 16 2.75,4.445
MODULE_ESP32-WROOM-32D = smd 2 x 0.9: 1 -8.5,5.26; 2 -8.5,3.99; 3 -8.5,2.72; 4 -8.5,1.45; 5 -8.5,0.18; 6 -8.5,-1.09; 7 -8.5,-2.36; 8 -8.5,-3.63; 9 -8.5,-4.9; 10 -8.5,-6.17; 11 -8.5,-7.44; 12 -8.5,-8.71; 13 -8.5,-9.98; 14 -8.5,-11.25; 25 8.5,-11.25; 26 8.5,-9.98; 27 8.5,-8.71; 28 8.5,-7.44; 29 8.5,-6.17; 30 8.5,-4.9; 31 8.5,-3.63; 32 8.5,-2.36; 33 8.5,-1.09; 34 8.5,0.18; 35 8.5,1.45; 36 8.5,2.72; 37 8.5,3.99; 38 8.5,5.26 | smd 0.9 x 2: 15 -5.715,-12.25; 16 -4.445,-12.25; 17 -3.175,-12.25; 18 -1.905,-12.25; 19 -0.635,-12.25; 20 0.635,-12.25; 21 1.905,-12.25; 22 3.175,-12.25; 23 4.445,-12.25; 24 5.715,-12.25 | smd 1.33 x 1.33: 39_1 -2.835,-0.405; 39_2 -1,-0.405; 39_3 0.835,-0.405; 39_4 -2.835,-2.24; 39_5 -1,-2.24; 39_6 0.835,-2.24; 39_7 -2.835,-4.075; 39_8 -1,-4.075; 39_9 0.835,-4.075 | drill 0.2 pad 0.3: 39_10 -1.917,-0.405; 39_11 -0.083,-0.405; 39_12 -2.835,-1.323; 39_13 -1,-1.323; 39_14 0.835,-1.323; 39_15 -1.917,-2.24; 39_16 -0.083,-2.24; 39_17 -2.835,-3.158; 39_18 -1,-3.158; 39_19 0.835,-3.158; 39_20 -1.917,-4.075; 39_21 -0.083,-4.075
SOT229P700X180-4N = smd 1.31 x 0.93: 1 -3.345,2.29; 2 -3.345,0; 3 -3.345,-2.29 | smd 1.31 x 3.24: 4 3.345,0
MINI_W5500 = drill 0.914 long: 3V3 21.844,-8.89; 3V3.2 21.844,-11.43; CS 1.524,-16.51; GND 1.524,-6.35; GND.2 1.524,-8.89; GND.3 21.844,-6.35; INT 1.524,-19.05; MISO 21.844,-19.05; MOSI 1.524,-11.43; NC 21.844,-13.97; RST 21.844,-16.51; SCLK 1.524,-13.97
MSTBA5 = drill 1.397 long: 1 -10.16,5.08; 2 -5.08,5.08; 3 0,5.08; 4 5.08,5.08; 5 10.16,5.08
MSTBA4 = drill 1.397 long: 1 -7.62,5.08; 2 -2.54,5.08; 3 2.54,5.08; 4 7.62,5.08
MSTBA3 = drill 1.397 long: 1 -5.08,5.08; 2 0,5.08; 3 5.08,5.08
MSTBA2 = drill 1.397 long: 1 -2.54,5.08; 2 2.54,5.08

### Placement (x,y rotation side)
C1  85.23,61.17 0 top
C2  85.23,57.89 0 top
C3  119.12,29.98 0 bottom
C4  119.05,46.18 0 bottom
C5  119.67,63.78 270 top
C6  105.78,69.35 0 top
C7  105.59,72.33 0 top
C8  85.24,64.63 180 top
C9  98.51,17.87 0 top
C10  60.96,16.94 90 top
C11  142.99,7.42 270 top
C12  145.6,7.38 270 top
D1  11.88,19.02 270 bottom
D2  17.66,19 270 bottom
D3  23.6,19.01 270 bottom
D4  29.58,19.03 270 bottom
D5  35.59,19.02 270 bottom
D6  13.63,63.96 90 bottom
D7  19.65,63.96 90 bottom
D8  25.37,63.98 90 bottom
D9  31.37,64.03 90 bottom
D10  37.25,64.04 90 bottom
D11  135.56,67.86 270 top
D12  132.43,67.89 270 top
D13  92.88,53.85 0 top
D14  84.23,73.68 90 top
D15  81.58,73.66 90 top
D17  15.01,28.27 0 top
D18  19.74,28.25 0 top
D19  24.62,28.26 0 top
D20  29.32,28.27 0 top
D21  34.3,28.27 0 top
D22  15.79,54.84 0 top
D23  20.69,54.83 0 top
D24  25.39,54.76 0 top
D25  30.02,54.75 0 top
D26  34.95,54.75 0 top
D33  14.7,19.02 270 bottom
D34  20.67,19.01 270 bottom
D35  26.51,19.02 270 bottom
D36  32.48,19.03 270 bottom
D37  38.69,19.01 270 bottom
D38  16.63,63.96 90 bottom
D39  22.48,63.99 90 bottom
D40  28.28,64 90 bottom
D41  34.33,64.04 90 bottom
D42  40.32,64.05 90 bottom
IC1  65.75,37.76 90 top
J1  151.1,31.27 270 top
J2  92.24,81.65 180 top
JP1  88.45,15.64 0 top
JP2  98.08,11.3 0 top
LORA-NICERF-V1  140.06,20.12 0 top
MINI1  129.08,32.76 90 top
PZEM-DC1  9.79,58.88 0 top
PZEM-DC2  150.36,75.36 270 top
Q1  80.56,60 90 top
Q2  119.14,35.35 90 bottom
Q3  119.13,41 90 bottom
R1  3.96,18.38 90 top
R2  12.74,18.41 90 top
R3  17.31,18.37 90 top
R4  21.89,18.37 90 top
R5  26.43,18.35 90 top
R6  4.22,64.72 270 top
R7  13.54,64.67 270 top
R8  18.1,64.64 270 top
R9  22.63,64.66 270 top
R10  27.16,64.67 270 top
R11  70.08,48.43 270 top
R12  67.79,48.41 270 top
R13  65.49,48.43 270 top
R14  63.23,48.41 270 top
R15  61.01,48.41 270 top
R16  58.84,48.4 270 top
R17  53.92,43.41 0 top
R18  53.93,41.24 0 top
R19  53.93,39.07 0 top
R20  53.92,36.88 0 top
R21  53.93,34.74 0 top
R22  53.93,32.57 0 top
R23  53.92,30.41 0 top
R24  53.94,28.2 0 top
R25  62.34,25.84 90 top
R26  64.61,25.86 90 top
R27  123.55,35.3 90 bottom
R28  123.52,40.97 270 bottom
R29  112.16,38.06 90 bottom
R30  114.81,38.08 270 bottom
R31  84.22,78.09 90 top
R32  81.57,78.09 90 top
R33  97.57,53.86 0 top
S3  119.12,26.53 0 bottom
S4  118.85,50.19 0 bottom
TTL-RS1  117.47,36.61 270 top
U1  14.46,35.53 90 top
U2  21.87,35.54 90 top
U3  29.28,35.54 90 top
U4  36.72,35.57 90 top
U5  44.23,35.56 90 top
U6  14.5,47.24 270 top
U7  21.87,47.24 270 top
U8  29.28,47.24 270 top
U9  36.72,47.24 270 top
U10  44.23,47.24 270 top
U11  54.4,18.52 0 top
U12  92.92,65.48 0 top
U13  91.43,38.16 0 top
U14  113.32,66.21 90 top
U$1  52.59,83.13 0 top
X1  14.15,2.05 0 top
X2  14,81.18 180 top
X4  38.88,81.14 180 top
X5  36.54,2.05 0 top
X6  53.81,2.07 0 top
X7  68.56,2.05 0 top
X8  80.79,2.08 0 top
X9  95.55,2.08 0 top

### Tracks (layer width: path | path; a pad name or v marks a point on that pad's centre or on a via)
3V3  (via drill 0.35)
  Top 0.203: v123.52,37.96 134.37,37.96 138.19,41.77 138.19,79.06 135.58,81.67 116.33,81.67 113.34,78.68 113.34,71.63 v113.38,71.59 | U14.2 U14.4
  Top 0.254: R31.2 86,79.04 86.54,78.51 86.54,75.92 87.64,74.82 v90.73,74.82 | v113.38,71.59 113.38,69.62 U14.4
  Top 0.305: R32.2 R31.2 | C6.2 106.98,69.55 U14.4 | U13.2 87.05,42.15 v88.17,43.27 | C12.1 145.56,8.42 C11.1 142.99,12.91 | 142.99,12.91 142.07,13.83 132.14,13.83 131.99,13.68 131.63,13.68 LORA-NICERF-V1.VCC | 142.99,12.91 142.99,27.38 140.07,30.3 140.07,36.4 138.51,37.96 134.37,37.96
  Bottom 0.203: R27.2 123.52,36.28 v123.52,37.96 R28.2
  Bottom 0.254: v90.73,74.82 112.2,74.82 113.38,73.63 v113.38,71.59
  Bottom 0.305: v88.17,43.27 88.17,61.18 83.57,65.78 83.57,72.71 85.68,74.82 v90.73,74.82
12V
  Top 0.254: MINI1.IN+ 127.93,32.76 125.62,30.45 125.62,14.52 123.26,12.16
  Top 0.305: JP1.3 92.31,14.33 107.2,14.33 109.37,12.16 123.26,12.16
  Top 0.406: X5.1 31.46,4.64 32.35,3.75 48.05,3.75 48.73,4.43 X6.1
  Bottom 0.305: X6.1 48.73,4.45 49.56,3.62 91.5,3.62 92.95,5.06 92.95,12.24 91,14.19 JP1.3
A0
  Top 0.254: X5.2 36.54,9.42 37.79,10.68 48.32,10.68 50.21,12.57 50.21,17.28 50.95,18.02 U11.4
A1
  Top 0.254: X6.2 53.81,16.88 53.17,17.52 U11.5
A+
  Bottom 0.203: TTL-RS1.A 111.47,54.22 112.46,53.23 122.68,53.23 125.62,56.17 125.62,70.87 129.65,74.91 PZEM-DC2.A+ 129.66,78.71 128.35,80.02 37.81,80.02 36.34,78.54 X4.3
  Bottom 0.254: PZEM-DC1.A+ 8.78,38.17 9.84,39.23 9.84,47.09 12.02,49.27 39.86,49.27 43.18,52.6 43.18,68.59 36.34,75.43 X4.3
ANT
  Top 0.203: LORA-NICERF-V1.ANT 149.23,30.94 J1.3
B-
  Bottom 0.203: TTL-RS1.B 116.47,57.98 118.05,59.55 122.63,59.55 124.57,61.5 124.57,77.1 PZEM-DC2.B- 124.57,78.49 123.62,79.45 43.25,79.45 41.42,77.61 X4.2
  Bottom 0.254: PZEM-DC1.B- 9.28,33.09 10.64,34.45 10.64,46.74 12.41,48.51 40.02,48.51 43.81,52.3 43.81,69.09 41.37,71.53 41.37,76.01 X4.2
COMM  (via drill 0.35)
  Top 0.406: 20.09,49.65 13.87,49.65 13.23,50.29 U6.2 13.18,51.43 v10.99,51.43 10.99,34.64 12.1,33.53 16.21,33.53 | 20.09,49.65 20.77,50.33 20.77,51.32 U7.2 | 20.09,49.65 27.48,49.65 | 27.48,49.65 28.05,50.22 28.05,51.46 U8.2 | 27.48,49.65 35.01,49.65 | U9.2 35.45,50.09 35.01,49.65 | 35.01,49.65 42.62,49.65 42.96,49.98 U10.2 | U1.2 15.73,33.05 16.21,33.53 | 22.46,33.53 16.21,33.53 | 22.46,33.53 23.16,32.83 23.16,31.3 U2.2 | 22.46,33.53 29.94,33.53 | U3.2 30.55,32.92 29.94,33.53 | 29.94,33.53 37.42,33.53 | U4.2 37.99,32.96 37.42,33.53 | 37.42,33.53 44.74,33.53 45.5,32.77 U5.2 45.54,31.26 45.54,29.23 41.75,25.43 v41.75,15.54
  Bottom 0.406: 18.99,69.18 14.46,69.18 13.63,68.35 D6.A 11.32,65.86 9.61,64.15 9.61,52.81 v10.99,51.43 | D7.A 19.65,68.51 18.99,69.18 | 18.99,69.18 24.59,69.18 | 24.59,69.18 25.38,68.38 25.38,65.89 D8.A | 24.59,69.18 30.58,69.18 | D9.A 31.37,68.39 30.58,69.18 | 30.58,69.18 36.63,69.18 37.25,68.55 D10.A | D1.A 11.88,14.57 12.57,13.87 16.98,13.87 | 16.98,13.87 17.67,14.57 17.67,17.08 D2.A | 16.98,13.87 22.83,13.87 | 22.83,13.87 23.62,14.66 23.62,17.09 D3.A | 22.83,13.87 28.98,13.87 | D4.A 29.58,14.47 28.98,13.87 | 28.98,13.87 34.87,13.87 | 34.87,13.87 35.61,14.61 35.61,17.09 D5.A | 34.87,13.87 35.49,13.25 39.46,13.25 41.2,15 v41.75,15.54
  Bottom 0.61: X9.1 90.47,8.86 88.44,10.89 52.57,10.89 47.99,15.47 41.68,15.47 41.2,15
DIO0_LORA  (via drill 0.35)
  Top 0.203: LORA-NICERF-V1.DIO0 129.67,15.09 v129.23,14.65 | v86.18,31.98 82.95,31.98 U13.10
  Bottom 0.203: v129.23,14.65 127.56,14.65 123.66,10.75 108.54,10.75 105.83,13.46 105.83,17.9 104.42,19.31 90.75,19.31 88,22.06 88,28.66 86.64,30.02 86.64,31.52 v86.18,31.98
DIO1_LORA  (via drill 0.35)
  Top 0.203: LORA-NICERF-V1.DIO1 129.26,16.36 v129.09,16.19 | v87.65,30.68 82.98,30.68 U13.11
  Bottom 0.203: v129.09,16.19 128.36,16.19 123.35,11.17 108.97,11.17 106.27,13.87 106.27,18.4 104.86,19.82 91.05,19.82 88.47,22.4 88.47,29.86 v87.65,30.68
DTR  (via drill 0.35)
  Top 0.203: U12.13 98.89,66.12 100.26,64.75 100.26,58.36 115.05,43.57 115.05,42.03 115.02,42 v115.02,41.95
  Bottom 0.203: R29.2 112.16,40.8 113.32,41.95 v115.02,41.95 Q3.2
EN  (via drill 0.35)
  Top 0.203: U13.3 92.92,40.88 95.02,38.78 95.02,31.87 v97.11,29.78
  Bottom 0.203: Q2.3 121.24,34.35 | R27.1 121.25,34.35 121.24,34.35 | 121.24,34.35 120.5,34.35 120.12,33.97 C3.1 120.12,27.61 S3.1 121.19,24.57 120.82,24.2 115.9,24.2 110.32,29.78 v97.11,29.78
GND  (via drill 0.35)
  Top 0.203: C9.- 94.12,17.87 v94.09,17.9 | R15.1 61.01,50.94 61.08,51 | 61.08,51 | 61.08,51 v61.07,51.01 | R14.1 63.19,49.4 v63.19,51.05 | R13.1 65.43,49.44 v65.43,51.03 | C7.2 108.07,72.33 v108.1,72.29 | C6.1 103.37,69.35 v103.35,69.32 | C10.1 60.96,14.65 v60.97,14.63 | U11.3 50.62,18.52 50.41,18.73 v50.41,19.06 50.41,19.3 50.68,19.57 52.2,19.57 U11.1 | IC1.10 70.88,39.38 v71.74,40.24 | J1.2 151.61,29.29 v151.61,28.32 | J1.1 151.1,34 151.3,34.19 v151.3,34.21 | LORA-NICERF-V1.GND1 150.69,25.43 v150.76,25.36 | C11.2 v142.99,5.09 | C12.2 145.6,5.14 v145.58,5.13
  Top 0.254: J2.5 89.56,78.68 J2.S2 | LORA-NICERF-V1.GND 129.76,26.52 v129.71,26.47
  Top 0.305: C1.1 84.15,61.09 v82.85,61.09 | C2.1 84.15,57.81 v82.89,57.81 | C8.2 84.06,64.45 83.02,64.45 v82.98,64.49 | U12.1 88.82,69.93 v88.81,69.94 | D13.C 90.48,53.85 v90.37,53.97 | U13.39_1 88.66,37.76 88.6,37.7 88.6,37.5 | U13.39_10 90.36,37.76 | 90.36,37.76 U13.39_2 90.66,37.76 | 92.27,37.45 U13.39_3 | 92.27,36.14 U13.39_6 | 90.36,37.49 90.36,37.76 | 90.43,36.12 U13.39_5 90.45,35.92 | 88.6,36.16 U13.39_4 88.63,35.92 88.6,35.9 | 90.6,35.92 90.45,35.92 | 92.08,35.92 U13.39_6 | 92.27,35.62 U13.39_6 | 92.27,34.31 92.27,34.12 | 92.27,34.12 U13.39_9 | 92.12,34.12 92.27,34.12 | U13.39_18 90.43,35.9 90.45,35.92 | U13.39_20 U13.39_8 | 88.6,34.24 U13.39_7 | U14.1 111.03,61.06 v111.06,61.03 | C5.1 119.67,66.5 v119.62,66.55 | U13.15 v85.72,23.35 v85.72,23.34 | U13.38 97.93,43.42 v97.88,43.48 v97.87,43.47 | U13.1 85.05,43.42 v85.06,43.43
  Top 0.406: J2.S2 v89.04,77.42 v89.03,77.41 | 88.66,37.76 U13.39_10 U13.39_2 | 90.66,37.76 U13.39_11 U13.39_3 | 92.27,37.45 U13.39_14 92.27,36.14 | 90.36,37.49 90.36,36.92 U13.39_13 90.43,36.12 U13.39_18 U13.39_8 | 88.6,37.5 U13.39_12 88.6,36.16 | 88.63,35.92 U13.39_15 U13.39_5 | 90.6,35.92 U13.39_16 92.08,35.92 | 92.27,35.62 U13.39_19 92.27,34.31 | 88.6,35.9 U13.39_17 88.6,34.24 | U13.39_20 U13.39_7 U13.39_8 | U13.39_8 U13.39_21 91.39,34.12 92.12,34.12 | U6.3 v13.23,44.75 v13.23,44.76 v13.22,44.75 | U1.3 15.73,38.21 15.71,38.19 v15.71,38.15 | U7.3 20.52,43.08 20.52,44.72 v20.55,44.75 | U2.3 23.14,37.98 v23.16,37.96 | U8.3 28.01,44.76 28.02,44.78 v28.04,44.76 | U3.3 30.57,39.76 30.57,37.85 v30.59,37.85 | U9.3 35.45,44.69 v35.42,44.72 | U4.3 37.99,38.1 v38.05,38.04 | U10.3 42.96,44.83 v42.95,44.84 | U5.3 45.5,38.03 v45.51,38.01
  Top 0.61: J2.S2 88.94,79.3 J2.S6 J2.S3 J2.S4 J2.S5 95.44,81.55 J2.S1
  Bottom 0.203: S3.2 115.86,26.53 v115.83,26.56 | C3.2 116.68,29.98 v116.65,30.01 | C4.2 117.99,46.11 v116.76,46.11 | S4.2 116.72,50.13 v115.43,50.13
  pour Top (isolate 0.406): 0.2,82.71 154.2,82.71 154.2,47.71 152.2,47.71 151.2,47.71 151.2,35.71 154.2,35.71 154.2,-0.29 0.2,-0.29 0.2,35.71 2.2,35.71 2.2,47.71 0.2,47.71
  pour Bottom (isolate 0.406): 0.2,82.71 154.2,82.71 154.2,47.71 151.2,47.71 151.2,35.71 154.2,35.71 154.2,-0.29 0.2,-0.29 0.2,35.71 2.2,35.71 2.2,47.71 0.2,47.71
IO0  (via drill 0.35)
  Top 0.203: U13.25 101.96,26.91 v102.01,26.97
  Bottom 0.203: 123.42,41.92 120.63,41.92 120.23,41.53 Q3.3 120.23,46 C4.1 120.93,47.05 S4.1 | 123.42,41.92 R28.1 | v102.01,26.97 111.93,26.97 115.49,23.42 124.37,23.42 127.2,26.25 127.2,40.74 126,41.94 123.43,41.94 123.42,41.92
MISO_HSPI  (via drill 0.35)
  Top 0.203: LORA-NICERF-V1.MISO v129.09,21.44 | v92.98,21.74 84.26,21.74 82.86,23.14 82.86,26.84 U13.14
  Bottom 0.203: v129.09,21.44 128.57,21.44 123.47,16.35 123.47,13.99 122.35,12.87 109.85,12.87 107.94,14.78 107.94,20.15 106.66,21.44 93.28,21.44 v92.98,21.74
MISO_LAN
  Top 0.254: U$1.MISO 74.43,55.89 78.85,51.47 88.93,51.47 95.14,45.26 102.11,45.26 102.85,44.52 102.85,35.21 102.14,34.51 99.96,34.51 U13.31
MOSI_HSPI  (via drill 0.35)
  Top 0.203: LORA-NICERF-V1.MOSI 129.48,20.17 v129.18,19.87 | v90.7,22.86 88.28,22.86 86.99,24.14 U13.16
  Bottom 0.203: v129.18,19.87 129.02,19.87 124.03,14.88 124.03,13.69 122.69,12.35 109.45,12.35 107.42,14.38 107.42,19.76 106.43,20.75 92.71,20.75 90.7,22.75 v90.7,22.86
MOSI_LAN
  Top 0.203: U$1.MOSI 63.48,71.7 66.5,68.68 66.5,62.62 78.42,50.7 88.18,50.7 96.72,42.15 U13.37
N$1  (via drill 0.35)
  Top 0.254: v15.5,25.53 15.91,25.94 D17.A
  Bottom 0.254: D33.C 14.7,23.64 15.59,24.52 15.59,25.44 v15.5,25.53
N$2  (via drill 0.35)
  Top 0.254: v14.72,14.87 11.62,14.87 9.92,13.17 6.21,13.17 3.93,15.45 3.93,25.98 R1.2
  Bottom 0.254: D33.A 14.72,16.86 v14.72,14.87
N$3  (via drill 0.35)
  Top 0.254: v14.49,26.44 14.11,26.83 D17.C 13.62,28.27 13.19,28.7 U1.1
  Bottom 0.254: D1.C 11.88,22.14 14.49,24.75 v14.49,26.44
N$4
  Top 1.016: X9.3 100.63,11.29 JP2.3
N$5  (via drill 0.35)
  Top 0.254: v20.76,14.87 16.25,14.87 12.74,18.38 R2.2
  Bottom 0.254: D34.A 20.68,14.95 v20.76,14.87
N$6  (via drill 0.35)
  Top 0.254: v20.31,24.7 20.31,27.93 D18.A
  Bottom 0.254: D34.C 20.31,21.51 v20.31,24.7
N$7  (via drill 0.35)
  Top 0.254: v19.16,25.7 18.84,26.02 D18.C 18.84,30.64 19.48,31.29 U2.1
  Bottom 0.254: D2.C 17.66,23.11 19.28,24.73 19.28,25.58 v19.16,25.7
N$8  (via drill 0.35)
  Top 0.254: v26.58,14.95 22.76,14.95 21.74,15.97 18.84,15.97 17.29,17.51 17.29,25.97 R3.2
  Bottom 0.254: D35.A 26.51,15.02 v26.58,14.95
N$9  (via drill 0.35)
  Top 0.254: v24.62,25.57 24.62,26.45 25.52,27.35 D19.A
  Bottom 0.254: D35.C 26.51,22.27 24.62,24.16 v24.62,25.57
N$10  (via drill 0.35)
  Top 0.254: v23.69,26.61 23.69,28.24 D19.C 23.72,29.13 25.88,31.29 U3.1
  Bottom 0.254: D3.C 23.6,26.49 23.69,26.59 v23.69,26.61
N$11  (via drill 0.35)
  Top 0.254: v32.7,14.96 29.97,14.96 27.93,17.01 23.47,17.01 21.87,18.61 21.87,25.97 R4.2
  Bottom 0.254: D36.A 32.7,16.68 v32.7,14.96
N$12  (via drill 0.35)
  Top 0.254: v30.26,26.24 30.26,28.24 D20.A
  Bottom 0.254: D36.C 32.48,24.02 v30.26,26.24 | v30.26,26.24
N$13  (via drill 0.35)
  Top 0.254: v28.41,26.38 28.41,28.25 D20.C 28.42,29.11 28.85,29.54 31.38,29.54 33.18,31.34 35.44,31.34 U4.1
  Bottom 0.254: D4.C 29.58,25.21 v28.41,26.38
N$14
  Top 1.016: X9.2 95.55,11.29 JP2.1
N$15
  Top 0.305: MINI1.OUT+ 133.96,58.43 135.59,60.05 135.59,66.15 D11.A
N$16
  Top 0.305: D13.A 96.61,53.85 R33.1
N$17  (via drill 0.35)
  Top 0.254: v38.86,14.87 36.59,14.87 33.07,18.4 27.36,18.4 26.33,19.42 26.33,25.88 R5.2
  Bottom 0.254: D37.A 38.91,16.66 38.91,14.87 v38.86,14.87
N$18  (via drill 0.35)
  Top 0.254: v35.23,26.33 35.2,26.36 D21.A
  Bottom 0.254: D37.C 38.69,22.87 v35.23,26.33
N$19  (via drill 0.35)
  Top 0.254: v33.29,26.27 33.29,28.16 D21.C 33.4,29.06 33.97,29.64 39.49,29.64 41.17,31.32 42.94,31.32 U5.1
  Bottom 0.254: D5.C 35.59,23.97 v33.29,26.27 | v33.29,26.27
N$20  (via drill 0.35)
  Top 0.254: v16.59,68.02 16.59,67.43 13.77,64.62 13.77,60.64 10.22,57.08 4.25,57.08 R6.2
  Bottom 0.254: D38.A 16.63,67.99 16.6,68.02 v16.59,68.02
N$21  (via drill 0.35)
  Top 0.254: v16.32,57.64 16.32,55.21 D22.A
  Bottom 0.254: D38.C 16.32,61.52 v16.32,57.64
N$22  (via drill 0.35)
  Top 0.254: v15.3,56.97 15.3,55.25 D22.C 14.89,53.56 15.77,52.67 U6.1
  Bottom 0.254: D6.C 13.63,59.65 15.3,57.99 v15.3,56.97
N$23
  Top 0.203: IC1.18 60.83,40.03 59.93,40.94 59.93,45.09 58.84,46.17 R16.2
N$24
  Top 0.203: C8.1 87.05,64.63 88.54,66.12 U12.4
N$25  (via drill 0.35)
  Top 0.254: v22.45,68.04 18.38,68.04 14.63,64.29 14.63,58.13 R7.2
  Bottom 0.254: D39.A 22.48,68.01 v22.45,68.04
N$26  (via drill 0.35)
  Top 0.254: v20.98,57.66 20.98,56.24 21.59,55.63 D23.A
  Bottom 0.254: D39.C 20.98,60.36 v20.98,57.66
N$27  (via drill 0.35)
  Top 0.254: v20,57.01 19.79,56.8 D23.C 19.79,53.8 20.23,53.37 22.54,53.37 23.14,52.76 U7.1
  Bottom 0.254: D7.C 19.65,57.35 v20,57.01
N$28  (via drill 0.35)
  Top 0.254: v28.32,68.09 23.91,68.09 22.69,66.87 19.44,66.87 18.1,65.53 R8.2
  Bottom 0.254: D40.A 28.28,68.06 v28.32,68.09
N$29  (via drill 0.35)
  Top 0.254: v25.66,58.09 25.66,56.25 26.29,55.62 D24.A
  Bottom 0.254: D40.C 25.66,59.24 v25.66,58.09
N$30  (via drill 0.35)
  Top 0.254: v24.47,57.6 24.47,54.79 D24.C 24.49,53.69 25.05,53.13 30.1,53.13 30.55,52.68 U8.1
  Bottom 0.254: D8.C 25.37,60.41 24.22,59.26 24.22,57.85 v24.47,57.6
N$32
  Top 0.203: IC1.15 64.35,41.98 65.49,43.12 R13.2
N$33  (via drill 0.35)
  Top 0.254: v34.35,68.11 30.22,68.11 28.37,66.26 23.62,66.26 22.58,65.22 22.58,57.09 R9.2
  Bottom 0.254: D41.A 34.33,68.11 v34.34,68.12 v34.35,68.11
N$34  (via drill 0.35)
  Top 0.254: v30.91,56.86 30.91,54.76 D25.A
  Bottom 0.254: D41.C 34.33,60.28 v30.91,56.86
N$35  (via drill 0.35)
  Top 0.254: D25.C 29.16,54.79 29.16,56.94 v29.16,57.09 29.16,57.75 29.83,58.42 31.81,58.42 32.35,57.88 32.35,53.85 32.97,53.23 37.43,53.23 37.99,52.66 U9.1
  Bottom 0.254: D9.C 31.37,59.3 v29.16,57.09
N$36  (via drill 0.35)
  Top 0.254: v40.11,68.24 36.34,68.24 33.61,65.51 29.13,65.51 27.16,63.54 R10.2
  Bottom 0.254: D42.A 40.15,66.36 40.15,68.23 40.13,68.24 v40.11,68.24
N$37  (via drill 0.35)
  Top 0.254: v35.92,56.69 35.92,54.82 D26.A
  Bottom 0.254: D42.C 40.32,61.09 v35.92,56.69
N$38  (via drill 0.35)
  Top 0.254: D26.C 34.08,54.79 v34.08,56.95 34.08,57.59 34.74,58.25 36.97,58.25 40.98,54.24 44.53,54.24 45.5,53.27 U10.1
  Bottom 0.254: D10.C 37.25,60.17 34.06,56.98 v34.08,56.95
N$39
  Top 0.203: IC1.16 61.09,41.33 60.75,41.67 60.75,42.43 61.17,42.86 62.8,42.86 63.24,43.3 R14.2
N$40
  Top 0.203: IC1.17 60.8,40.68 60.31,41.17 60.31,43.07 61.01,43.78 R15.2 | R15.2
N$42
  Top 0.203: D14.A 84.22,74.59 R31.1
N$43
  Top 0.203: D15.A R32.1
N$51
  Bottom 0.203: R29.1 112.16,35.39 113.15,34.4 Q2.1
N$52
  Bottom 0.203: R30.1 115.83,40.05 Q3.1
N$54
  Top 0.305: Q1.2 80.56,64.5 82.23,62.83 85.69,62.83 | C1.2 86.23,62.29 85.69,62.83 | 85.69,62.83 87.99,62.83 88.52,62.31 U12.7
N$55
  Top 0.305: Q1.1 80.56,58.16 81.77,59.38 85.79,59.38 | 85.79,59.38 86.26,58.91 86.26,57.92 C2.2 | 85.79,59.38 89.68,59.38 90.17,59.87 U12.8
OUT1
  Top 0.203: IC1.21 60.3,38.08 59.4,38.98 59.4,42.99 58.92,43.47 54.93,43.47 | 54.93,43.47 R17.2 | U1.4 13.19,35.09 14.01,34.27 49.74,34.27 51.28,35.81 51.28,44.52 52.23,45.46 54.31,45.46 54.96,44.82 54.96,43.5 54.93,43.47
OUT2  (via drill 0.35)
  Top 0.203: IC1.22 60.31,37.43 58.94,38.81 58.94,40.8 58.47,41.26 v56.46,41.26 54.9,41.26 R18.2 | U2.4 20.6,35.31 21.21,34.7 49.39,34.7 50.8,36.11 50.8,44.83 52.05,46.08 55.79,46.08 56.6,45.26 v56.6,44.52
  Bottom 0.203: v56.6,44.52 56.66,44.46 56.66,41.46 v56.46,41.26
OUT3  (via drill 0.35)
  Top 0.203: IC1.23 60.34,36.78 58.01,39.11 v56.86,39.11 54.93,39.11 R19.2 | U3.4 28.01,35.78 28.58,35.21 49.12,35.21 50.31,36.4 50.31,46.36 v50.41,46.46
  Bottom 0.203: v50.41,46.46 56.29,46.46 57.56,45.2 57.56,39.85 56.86,39.15 v56.86,39.11
OUT4  (via drill 0.35)
  Top 0.203: IC1.24 60.08,36.13 59.3,36.91 v56.83,36.91 54.9,36.91 R20.2 | U4.4 35.45,36.27 36.03,35.69 48.5,35.69 49.46,36.66 49.46,47.49 49.88,47.91 50.35,47.91 v50.35,47.93
  Bottom 0.203: v56.83,36.91 56.83,36.89 58,38.07 58,45.46 56.56,46.9 52.04,46.9 51,47.93 v50.35,47.93
OUT5  (via drill 0.35)
  Top 0.203: IC1.25 60.04,35.48 59.31,34.75 v56.76,34.75 R21.2 | U5.4 42.96,36.73 43.53,36.15 47.56,36.15 48.93,37.52 48.93,48.68 49.54,49.29 v50.26,49.29
  Bottom 0.203: v50.26,49.29 51.45,49.29 53.43,47.31 56.77,47.31 58.42,45.67 58.42,36.41 56.76,34.76 v56.76,34.75
OUT6  (via drill 0.35)
  Top 0.203: IC1.26 60.35,34.83 58.09,32.57 v56.74,32.57 R22.2 | U6.4 15.77,46.9 17.29,48.42 45.63,48.42 v45.67,48.39
  Bottom 0.203: v45.67,48.39 47.78,48.39 49.71,50.32 51.36,50.32 53.75,47.92 56.82,47.92 58.86,45.88 58.86,34.71 56.74,32.6 v56.74,32.57
OUT7  (via drill 0.35)
  Top 0.203: IC1.27 60.56,34.18 v56.8,30.42 55.42,30.42 55.41,30.43 54.9,30.43 R23.2 | U7.4 23.14,46.62 23.85,47.32 46.14,47.32 46.81,47.99 46.81,49.92 50.76,53.87 v50.76,54.27
  Bottom 0.203: v50.76,54.27 50.76,51.74 54,48.5 57.19,48.5 59.4,46.3 59.4,33.06 56.8,30.47 v56.8,30.42
OUT8  (via drill 0.35)
  Top 0.203: IC1.28 61.38,33.53 v58.34,30.49 56.04,28.19 54.9,28.19 R24.2 | U8.4 30.55,46.07 31.32,46.84 46.68,46.84 47.4,47.57 47.4,49.77 50.84,53.2 52.57,53.2 v52.59,53.19 | v52.59,53.19
  Bottom 0.203: v52.59,53.19 52.59,50.76 54.34,49 57.47,49 59.86,46.62 59.86,31.98 58.35,30.48 v58.34,30.49
OUT9  (via drill 0.35)
  Top 0.203: R25.2 v62.34,30.48 62.93,31.07 70.07,31.07 70.6,31.6 70.6,33.32 70.38,33.54 69.38,33.54 IC1.1 | U9.4 37.99,45.37 38.85,46.23 47.43,46.23 48.02,46.82 48.02,49.59 50.57,52.14 54.38,52.14 v54.47,52.23
  Bottom 0.203: v54.47,52.23 54.47,50.15 55.15,49.47 57.62,49.47 60.45,46.64 60.45,32.31 62.31,30.44 62.34,30.47 v62.34,30.48
OUT10  (via drill 0.35)
  Top 0.203: R26.2 v64.61,29.75 65.44,30.59 70.27,30.59 71.11,31.43 71.11,33.56 70.48,34.18 IC1.2 | U10.4 46.87,42.99 48.46,44.58 48.46,49.08 50.53,51.15 56.46,51.15 v56.49,51.12
  Bottom 0.203: v56.49,51.12 56.67,51.12 60.98,46.82 60.98,33.33 64.58,29.73 v64.61,29.75
P1
  Bottom 0.61: R1.1 3.96,7.16 X1.1
P2
  Bottom 0.61: R2.1 10.39,10.79 9.07,9.47 X1.2
P3
  Bottom 0.61: R3.1 16.67,10.75 14.15,8.23 X1.3
P4
  Bottom 0.61: R4.1 19.23,8.09 X1.4
P5
  Bottom 0.61: R5.1 24.22,8.52 24.22,7.22 X1.5
P6
  Bottom 0.61: R6.1 4.22,75.72 X2.5
P7
  Bottom 0.61: R7.1 10.1,72.29 8.92,73.47 X2.4
P8
  Bottom 0.61: R8.1 17.03,72.26 14,75.29 X2.3
P9
  Bottom 0.61: R9.1 22.01,72.28 19.08,75.21 X2.2
P10
  Bottom 0.61: R10.1 24.16,75.29 X2.1
RST_LORA  (via drill 0.35)
  Top 0.203: LORA-NICERF-V1.NRST 129.23,12.55 v129.22,12.53 | v89.89,31.48 91.71,31.48 92.42,30.77 92.42,28.62 93.12,27.91 95.39,27.91 95.88,27.42 U13.23
  Bottom 0.203: v129.22,12.53 126.5,12.53 124.24,10.26 108.17,10.26 105.24,13.2 105.24,15.56 104.27,16.52 93.81,16.52 91.53,18.81 90.19,18.81 87.33,21.67 87.33,28.02 84.93,30.42 84.93,33.21 85.36,33.63 87.07,33.63 89.22,31.48 v89.89,31.48
RTS  (via drill 0.35)
  Top 0.203: U12.14 99.47,67.39 100.85,66 100.85,59.03 116.44,43.44 116.44,36.37 116.41,36.34 v116.41,36.3
  Bottom 0.203: R30.2 115.63,36.3 v116.41,36.3 Q2.2
RX  (via drill 0.35)
  Top 0.203: D15.C 81.58,71 85.19,67.39 v87.96,67.39 U12.3 | U13.35 101.35,39.61 v101.58,39.61
  Bottom 0.203: v101.58,39.61 102.3,40.33 102.3,64.26 99.11,67.45 88,67.45 87.96,67.4 v87.96,67.39
RX_RS485
  Top 0.203: TTL-RS1.RX 117.98,19.92 107.16,30.74 99.95,30.74 U13.28
SCK_HSPI  (via drill 0.35)
  Top 0.203: LORA-NICERF-V1.SCK 129.34,22.71 v128.84,23.21 | v90.21,28.25 83,28.25 U13.13
  Bottom 0.203: v128.84,23.21 128.47,23.21 122.87,17.61 122.87,14.32 122.02,13.47 110.22,13.47 108.54,15.14 108.54,23.63 107.46,24.71 96.26,24.71 92.7,28.27 90.21,28.27 v90.21,28.25
SCK_LAN
  Top 0.203: U$1.SCLK 63.41,69.16 65.84,66.74 65.84,61.75 77.91,49.68 87.97,49.68 96.49,41.16 96.49,34.26 97.51,33.24 99.91,33.24 U13.30
SCL  (via drill 0.35)
  Top 0.203: R11.2 v70.08,46.07 70.08,44.14 71.48,42.75 71.48,41.24 70.92,40.68 IC1.12 67.51,40.68 66.57,39.73 66.57,33.25 65.07,31.76 61.97,31.76 54.85,24.63 54.85,19.82 55.15,19.52 U11.10 | U13.36 97.59,40.88 v97.57,40.86
  Bottom 0.203: v97.57,40.86 83.16,40.86 75.23,40.86 70.02,46.07 v70.08,46.07
SDA  (via drill 0.35)
  Top 0.203: IC1.13 69.57,41.33 | 69.57,41.33 70.64,41.33 70.89,41.58 70.89,42.69 70.44,43.14 68.14,43.14 67.75,43.53 v67.75,45.4 67.75,47.42 R12.2 | U11.9 54.68,19.02 54.41,19.29 54.41,25.03 61.71,32.33 64.88,32.33 66.06,33.51 66.06,40.66 66.76,41.36 69.54,41.36 69.57,41.33 | U13.33 v97.73,37.07
  Bottom 0.203: v97.73,37.07 96.55,37.07 93.28,40.34 75,40.34 70.43,44.91 68.28,44.91 67.79,45.4 v67.75,45.4
SS_LAN
  Top 0.203: U$1.CS 63.34,66.62 64.75,65.21 64.75,61.41 77.18,48.98 87.48,48.98 95.91,40.55 95.91,33.84 97.75,31.99 U13.29
SS_LORA  (via drill 0.35)
  Top 0.203: LORA-NICERF-V1.NSS 129.77,18.9 v128.9,18.03 | U13.26 96.47,28.18 95.68,28.97 93.79,28.97 v93.78,28.96
  Bottom 0.203: v128.9,18.03 128.9,17.64 122.99,11.73 109.18,11.73 106.8,14.11 106.8,18.76 105.28,20.28 91.28,20.28 88.97,22.59 88.97,28.91 90.01,29.95 92.76,29.95 93.75,28.96 v93.78,28.96
TX  (via drill 0.35)
  Top 0.203: D14.C 84.23,70.08 85.65,68.66 v86,68.66 U12.2 | U13.34 101.15,38.34 101.83,37.67 v101.87,37.67
  Bottom 0.203: v101.87,37.67 102.45,37.67 102.82,38.04 102.82,64.52 98.66,68.69 86.03,68.69 v86,68.65 v86,68.66
TX_RS485
  Top 0.203: TTL-RS1.TX 114.98,21.58 107.07,29.49 99.97,29.49 U13.27
USB_N
  Top 0.203: J2.2 92.89,65.6 90.86,63.58 U12.6
USB_P
  Top 0.203: J2.3 92.24,65.45 91.61,64.83 90.19,64.83 U12.5
VCC  (via drill 0.35)
  Top 0.203: R16.1 58.84,51.66 59.43,52.25 66.97,52.25 67.79,51.42 R12.1 67.81,49.38 69.79,49.38 R11.1 | R24.1 52.97,28.22 R23.1 R22.1 | U11.8 60.38,18.52 C10.2
  Top 0.254: PZEM-DC1.VCC1 42.81,20.56 44.27,22.02 52.8,22.02 | 52.8,22.02 53.88,20.95 53.88,18.95 54.35,18.48 56.52,18.48 U11.8 | R26.1 64.6,24.89 R25.1 62.36,24.88 62.36,22.74 60.96,21.35 C10.2 | 52.8,22.02 52.99,22.21 R24.1 | IC1.9 72.23,38.73 72.97,39.47 72.97,48.72 72.17,49.52 70.22,49.52 R11.1 | R22.1 R21.1 52.98,36.87 R20.1 52.97,39.06 R19.1 R18.1 R17.1
  Top 0.305: U14.3 115.69,62.78 v117.54,62.78 C5.2 124.14,62.78 130.93,69.57 D12.C | D12.C 135.53,69.57 D11.C | D12.C 132.43,79.35 131.2,80.58 120.38,80.58 119.49,79.69 PZEM-DC2.5V | X4.1 46.5,78.05 47.61,79.16 65.78,79.16 70.7,74.24 U$1.3V3 | v70.15,51.51 70.15,49.73 69.79,49.38 | PZEM-DC2.VCC1 104.64,44.09 102.22,46.51 99.64,46.51 98.52,47.63 R33.2 98.52,55.52 v98.49,55.56 | 72.97,39.47 72.97,32.1 70.29,29.42 70.29,25.27 69.93,24.91 R26.1
  Top 0.406: U$1.3V3 U$1.3V3.2 | PZEM-DC1.VCC1 11.51,13.16 10.35,12 | 10.35,12 10.19,11.84 | 10.35,12 5.98,12 1.9,16.08 1.9,26.78 3.33,28.21 7.48,28.21 PZEM-DC1.5V
  Bottom 0.305: U$1.3V3.2 70.96,71.7 70.07,70.81 70.07,51.51 70.08,51.51 v70.15,51.51 70.15,49.1 72.4,46.85 78.59,46.85 80.5,44.94 80.5,42.44 81.42,41.52 92.53,41.52 98.49,47.47 v98.49,55.56 98.49,63.7 96.34,65.85 86.01,65.85 84.37,67.49 84.37,71.47 86.67,73.77 110.35,73.77 112.19,71.93 112.19,64.27 113.69,62.77 117.43,62.77 117.54,62.88 v117.54,62.78 | TTL-RS1.VCC 112,23.7 110.13,25.58 96.9,25.58 95.37,27.11 95.37,30.28 96.88,31.8 106.74,31.8 108.42,33.48 108.42,41.16 107.24,42.34 PZEM-DC2.VCC1
VOLT1+
  Top 0.61: X7.1 66.02,4.24 67.39,2.87 72.84,2.87 74.72,4.75 74.72,26.11 76.6,27.99 77.93,27.99 PZEM-DC1.VDC+
VOLT1-
  Top 0.61: X7.2 71.1,28.68 75.47,33.05 PZEM-DC1.VDC-
VOLT2+
  Top 0.61: X8.1 78.25,9.4 79.59,10.73 84.83,10.73 86.6,8.96 86.6,4.41 87.83,3.18 118.04,3.18 119.46,4.61 PZEM-DC2.VDC+
VOLT2-
  Top 0.61: X8.2 83.33,2.28 84.02,1.6 122.58,1.6 124.53,3.55 PZEM-DC2.VDC-
VUSB
  Top 0.305: J2.1 93.55,78.67 93.55,70.61 94.23,69.93 U12.16 100.48,69.92 100.5,69.95 | C7.1 102.88,72.33 100.5,69.95 | D12.A 130.12,66.21 124.76,60.85 | 124.76,60.85 113.26,60.85 112.01,59.59 103.65,59.59 101.52,61.72 101.52,69.04 100.6,69.95 100.5,69.95 | C9.+ 105.46,17.87 110.14,13.19 122.5,13.19 124.59,15.29 124.59,30.65 121.22,34.02 121.22,50.11 124.85,53.75 124.85,60.75 124.76,60.85